# EAGLE schematic microBoard_power (EAGLE 6.2)

## Sheet 1 of 8: Power-supplies
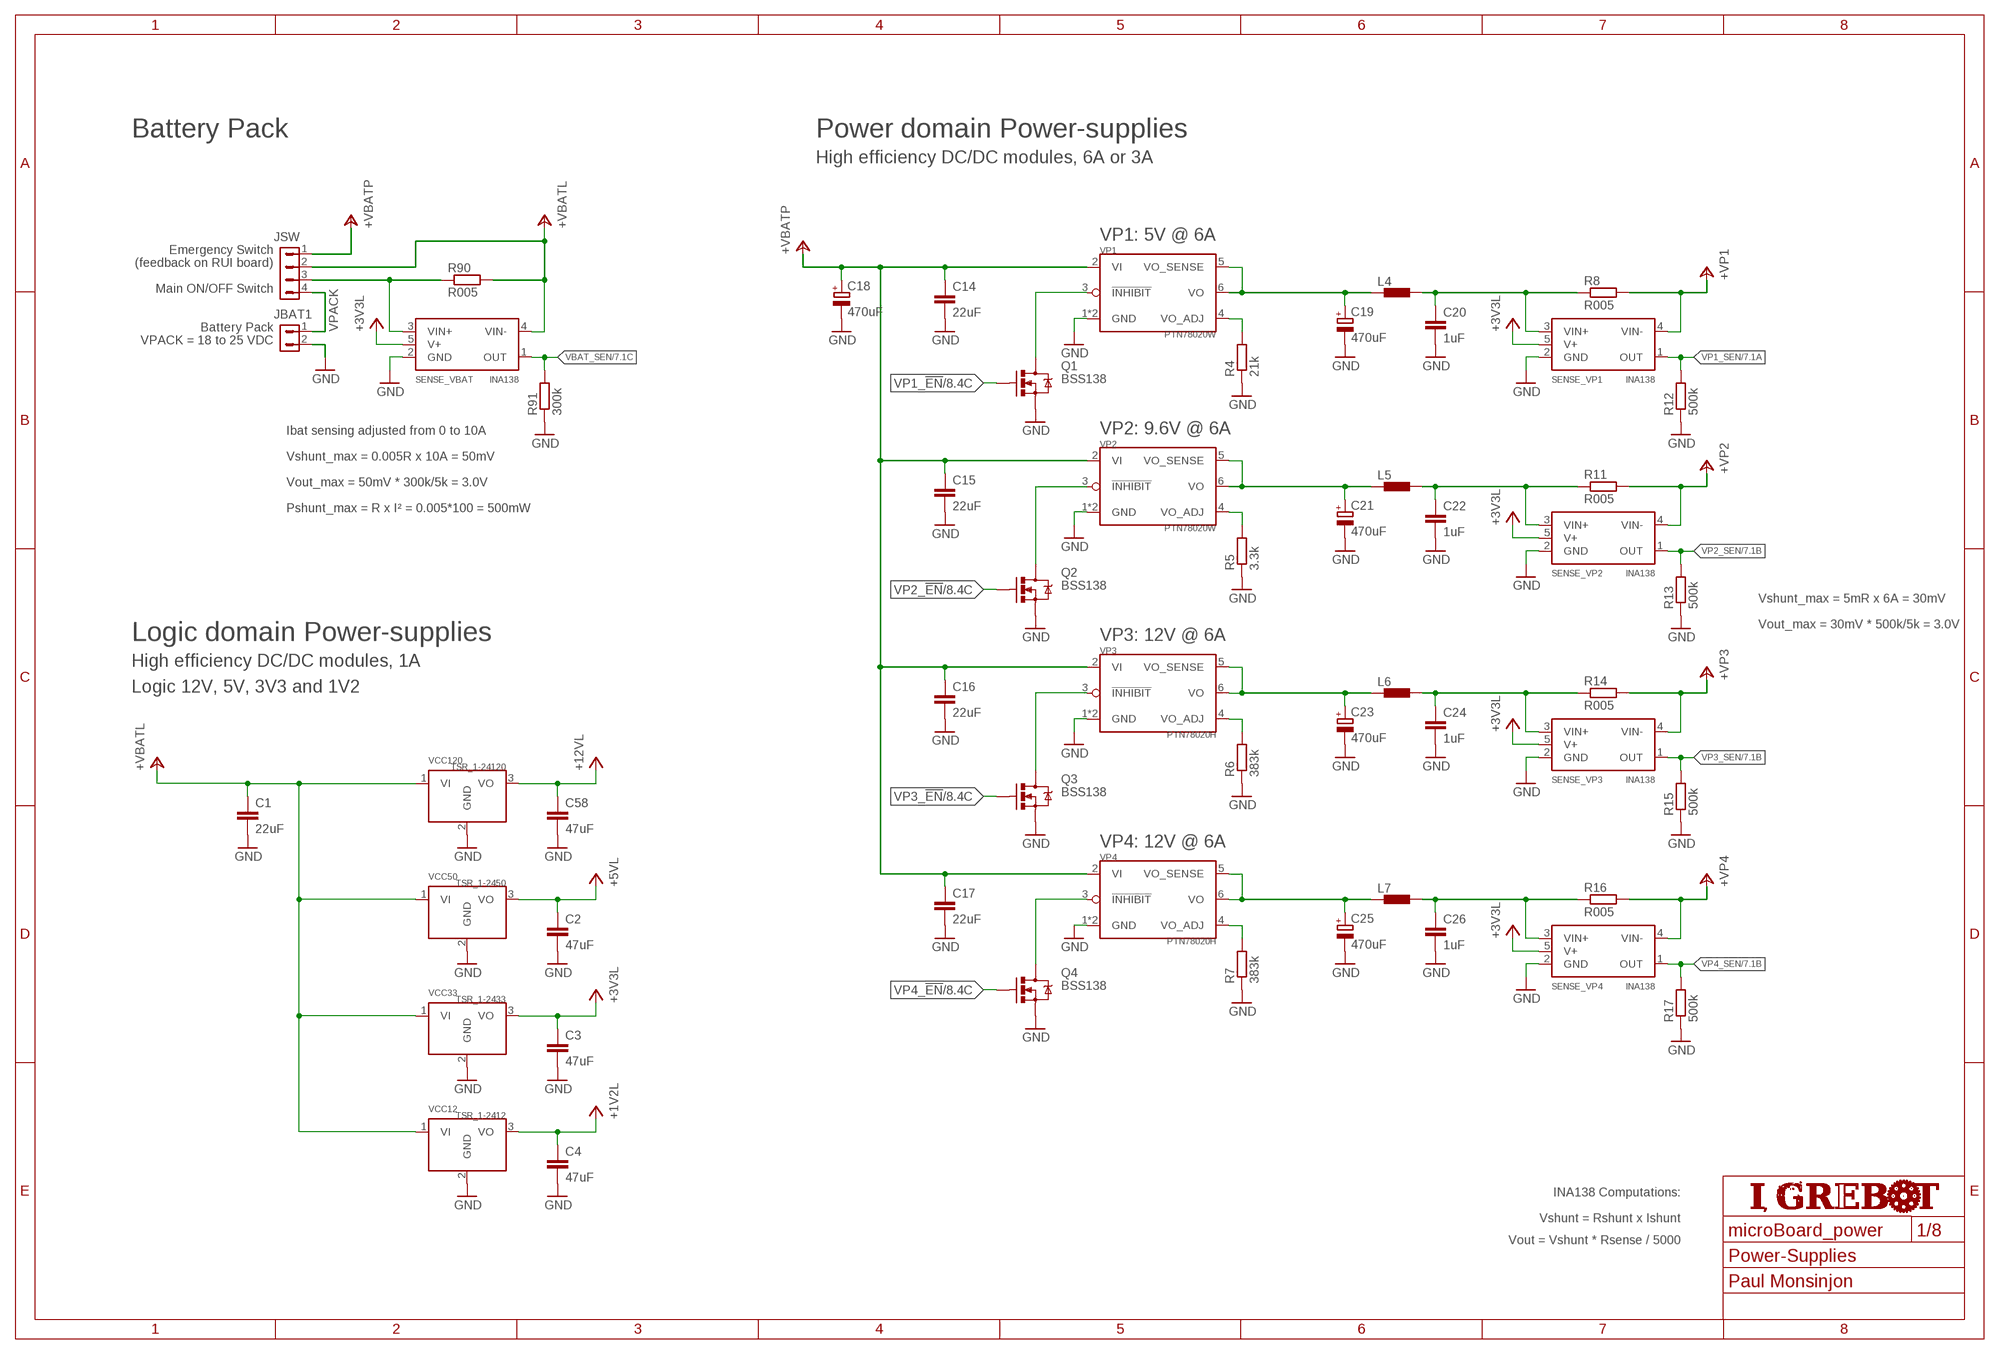
[diagram p0: schematic, sheet 1]
POWER-SUPPLIES (FRAME_A3): AUTHOR: Paul Monsinjon; SHEET_NAME: Power-Supplies

### Parts
C1  22uF  C-EUC3225  [C3225]
C2  47uF  C-EUC1210  [C1210]
C3  47uF  C-EUC1210  [C1210]
C4  47uF  C-EUC1210  [C1210]
C14  22uF  C-EUC3225  [C3225]
C15  22uF  C-EUC3225  [C3225]
C16  22uF  C-EUC3225  [C3225]
C17  22uF  C-EUC3225  [C3225]
C18  470uF  CPOL-EUB  [PANASONIC_B]
C19  470uF  CPOL-EUD  [PANASONIC_D]
C20  1uF  C-EUC3225  [C3225]
C21  470uF  CPOL-EUD  [PANASONIC_D]
C22  1uF  C-EUC3225  [C3225]
C23  470uF  CPOL-EUD  [PANASONIC_D]
C24  1uF  C-EUC3225  [C3225]
C25  470uF  CPOL-EUD  [PANASONIC_D]
C26  1uF  C-EUC3225  [C3225]
C58  47uF  C-EUC1210  [C1210]
JBAT1  MC15-GF-3.81-LR_2  [CON_3.81_LR_2]
JSW  MC15-GF-3.81-LR_4  [CON_3.81_LR_4]
L4  DR1030  [DR1030]
L5  DR1030  [DR1030]
L6  DR1030  [DR1030]
L7  DR1030  [DR1030]
Q1  BSS138  MOSFET-NCHANNELBSS138  [SOT23]
Q2  BSS138  MOSFET-NCHANNELBSS138  [SOT23]
Q3  BSS138  MOSFET-NCHANNELBSS138  [SOT23]
Q4  BSS138  MOSFET-NCHANNELBSS138  [SOT23]
R4  21k  R-EU_R0603  [R0603]
R5  3.3k  R-EU_R0603  [R0603]
R6  383k  R-EU_R0603  [R0603]
R7  383k  R-EU_R0603  [R0603]
R8  R005  R-EU_R2512  [R2512]
R11  R005  R-EU_R2512  [R2512]
R12  500k  R-EU_R0603  [R0603]
R13  500k  R-EU_R0603  [R0603]
R14  R005  R-EU_R2512  [R2512]
R15  500k  R-EU_R0603  [R0603]
R16  R005  R-EU_R2512  [R2512]
R17  500k  R-EU_R0603  [R0603]
R90  R005  R-EU_R2512  [R2512]
R91  300k  R-EU_R0603  [R0603]
SENSE_VBAT  INA138  [DBV_05]
SENSE_VP1  INA138  [DBV_05]
SENSE_VP2  INA138  [DBV_05]
SENSE_VP3  INA138  [DBV_05]
SENSE_VP4  INA138  [DBV_05]
VCC12  TSR_1-2412  TSR_1-24XX  [TSR1]
VCC33  TSR_1-2433  TSR_1-24XX  [TSR1]
VCC50  TSR_1-2450  TSR_1-24XX  [TSR1]
VCC120  TSR_1-24120  TSR_1-24XX  [TSR1]
VP1  PTN78020W  [PTN78020]
VP2  PTN78020W  [PTN78020]
VP3  PTN78020H  PTN78020W  [PTN78020]
VP4  PTN78020H  PTN78020W  [PTN78020]

### Nets
!INHIBIT!_VP1: Q1.3(D) VP1.3(!INHIBIT!)
!INHIBIT!_VP5: Q2.3(D) VP2.3(!INHIBIT!)
!INHIBIT!_VP6: Q3.3(D) VP3.3(!INHIBIT!)
!INHIBIT!_VP7: Q4.3(D) VP4.3(!INHIBIT!)
+1V2L: C4.1 VCC12.3(VO) ; also sheet 8
+3V3L: C3.1 SENSE_VBAT.5(V+) SENSE_VP1.5(V+) SENSE_VP2.5(V+) SENSE_VP3.5(V+) SENSE_VP4.5(V+) VCC33.3(VO) ; also sheet 3,7,8
+5VL: C2.1 VCC50.3(VO) ; also sheet 2,8
+12VL: C58.1 VCC120.3(VO) ; also sheet 8
+VBATL: C1.1 JSW.2 R90.2 SENSE_VBAT.4(VIN-) VCC12.1(VI) VCC33.1(VI) VCC50.1(VI) VCC120.1(VI)
+VBATP: C14.1 C15.1 C16.1 C17.1 C18.+ JSW.1 VP1.2(VI) VP2.2(VI) VP3.2(VI) VP4.2(VI) ; also sheet 3
+VP1: R8.2 SENSE_VP1.4(VIN-) ; also sheet 6
+VP2: R11.2 SENSE_VP2.4(VIN-) ; also sheet 6
+VP3: R14.2 SENSE_VP3.4(VIN-) ; also sheet 3
+VP4: R16.2 SENSE_VP4.4(VIN-) ; also sheet 4,5
GND: C1.2 C2.2 C3.2 C4.2 C14.2 C15.2 C16.2 C17.2 C18.- C19.- C20.2 C21.- C22.2 C23.- C24.2 C25.- C26.2 C58.2 JBAT1.2 Q1.2(S) Q2.2(S) Q3.2(S) Q4.2(S) R4.1 R5.1 R6.1 R7.1 R12.1 R13.1 R15.1 R17.1 R91.1 SENSE_VBAT.2(GND) SENSE_VP1.2(GND) SENSE_VP2.2(GND) SENSE_VP3.2(GND) SENSE_VP4.2(GND) VCC12.2(GND) VCC33.2(GND) VCC50.2(GND) VCC120.2(GND) VP1.1(GND) VP1.7(GND) VP2.1(GND) VP2.7(GND) VP3.1(GND) VP3.7(GND) VP4.1(GND) VP4.7(GND) ; also sheet 2,3,4,5,6,7,8
N$1: C19.+ L4.1 VP1.5(VO_SENSE) VP1.6(VO)
N$2: R7.2 VP4.4(VO_ADJ)
N$3: C20.1 L4.2 R8.1 SENSE_VP1.3(VIN+)
N$4: R6.2 VP3.4(VO_ADJ)
N$6: R5.2 VP2.4(VO_ADJ)
N$7: C21.+ L5.1 VP2.5(VO_SENSE) VP2.6(VO)
N$8: R4.2 VP1.4(VO_ADJ)
N$12: C22.1 L5.2 R11.1 SENSE_VP2.3(VIN+)
N$13: C23.+ L6.1 VP3.5(VO_SENSE) VP3.6(VO)
N$14: C24.1 L6.2 R14.1 SENSE_VP3.3(VIN+)
N$15: C25.+ L7.1 VP4.5(VO_SENSE) VP4.6(VO)
N$16: C26.1 L7.2 R16.1 SENSE_VP4.3(VIN+)
N$43: JSW.3 R90.1 SENSE_VBAT.3(VIN+)
VBAT_SEN: R91.2 SENSE_VBAT.1(OUT) ; also sheet 7
VP1_!EN!: Q1.1(G) ; also sheet 8
VP1_SEN: R12.2 SENSE_VP1.1(OUT) ; also sheet 7
VP2_!EN!: Q2.1(G) ; also sheet 8
VP2_SEN: R13.2 SENSE_VP2.1(OUT) ; also sheet 7
VP3_!EN!: Q3.1(G) ; also sheet 8
VP3_SEN: R15.2 SENSE_VP3.1(OUT) ; also sheet 7
VP4_!EN!: Q4.1(G) ; also sheet 8
VP4_SEN: R17.2 SENSE_VP4.1(OUT) ; also sheet 7
VPACK: JBAT1.1 JSW.4

### Notes on the sheet
- Battery Pack | Power domain Power-supplies
- High efficiency DC/DC modules, 6A or 3A
- VP1: 5V @ 6A
- Emergency Switch
- (feedback on RUI board)
- Main ON/OFF Switch
- Battery Pack
- VPACK = 18 to 25 VDC
- Ibat sensing adjusted from 0 to 10A | VP2: 9.6V @ 6A
- Vshunt_max = 0.005R x 10A = 50mV
- Vout_max = 50mV * 300k/5k = 3.0V
- Pshunt_max = R x I² = 0.005*100 = 500mW
- Vshunt_max = 5mR x 6A = 30mV
- Vout_max = 30mV * 500k/5k = 3.0V
- Logic domain Power-supplies | VP3: 12V @ 6A
- High efficiency DC/DC modules, 1A
- Logic 12V, 5V, 3V3 and 1V2
- VP4: 12V @ 6A
- INA138 Computations:
- Vshunt = Rshunt x Ishunt
- Vout = Vshunt * Rsense / 5000

## Sheet 2 of 8: Battery Monitoring
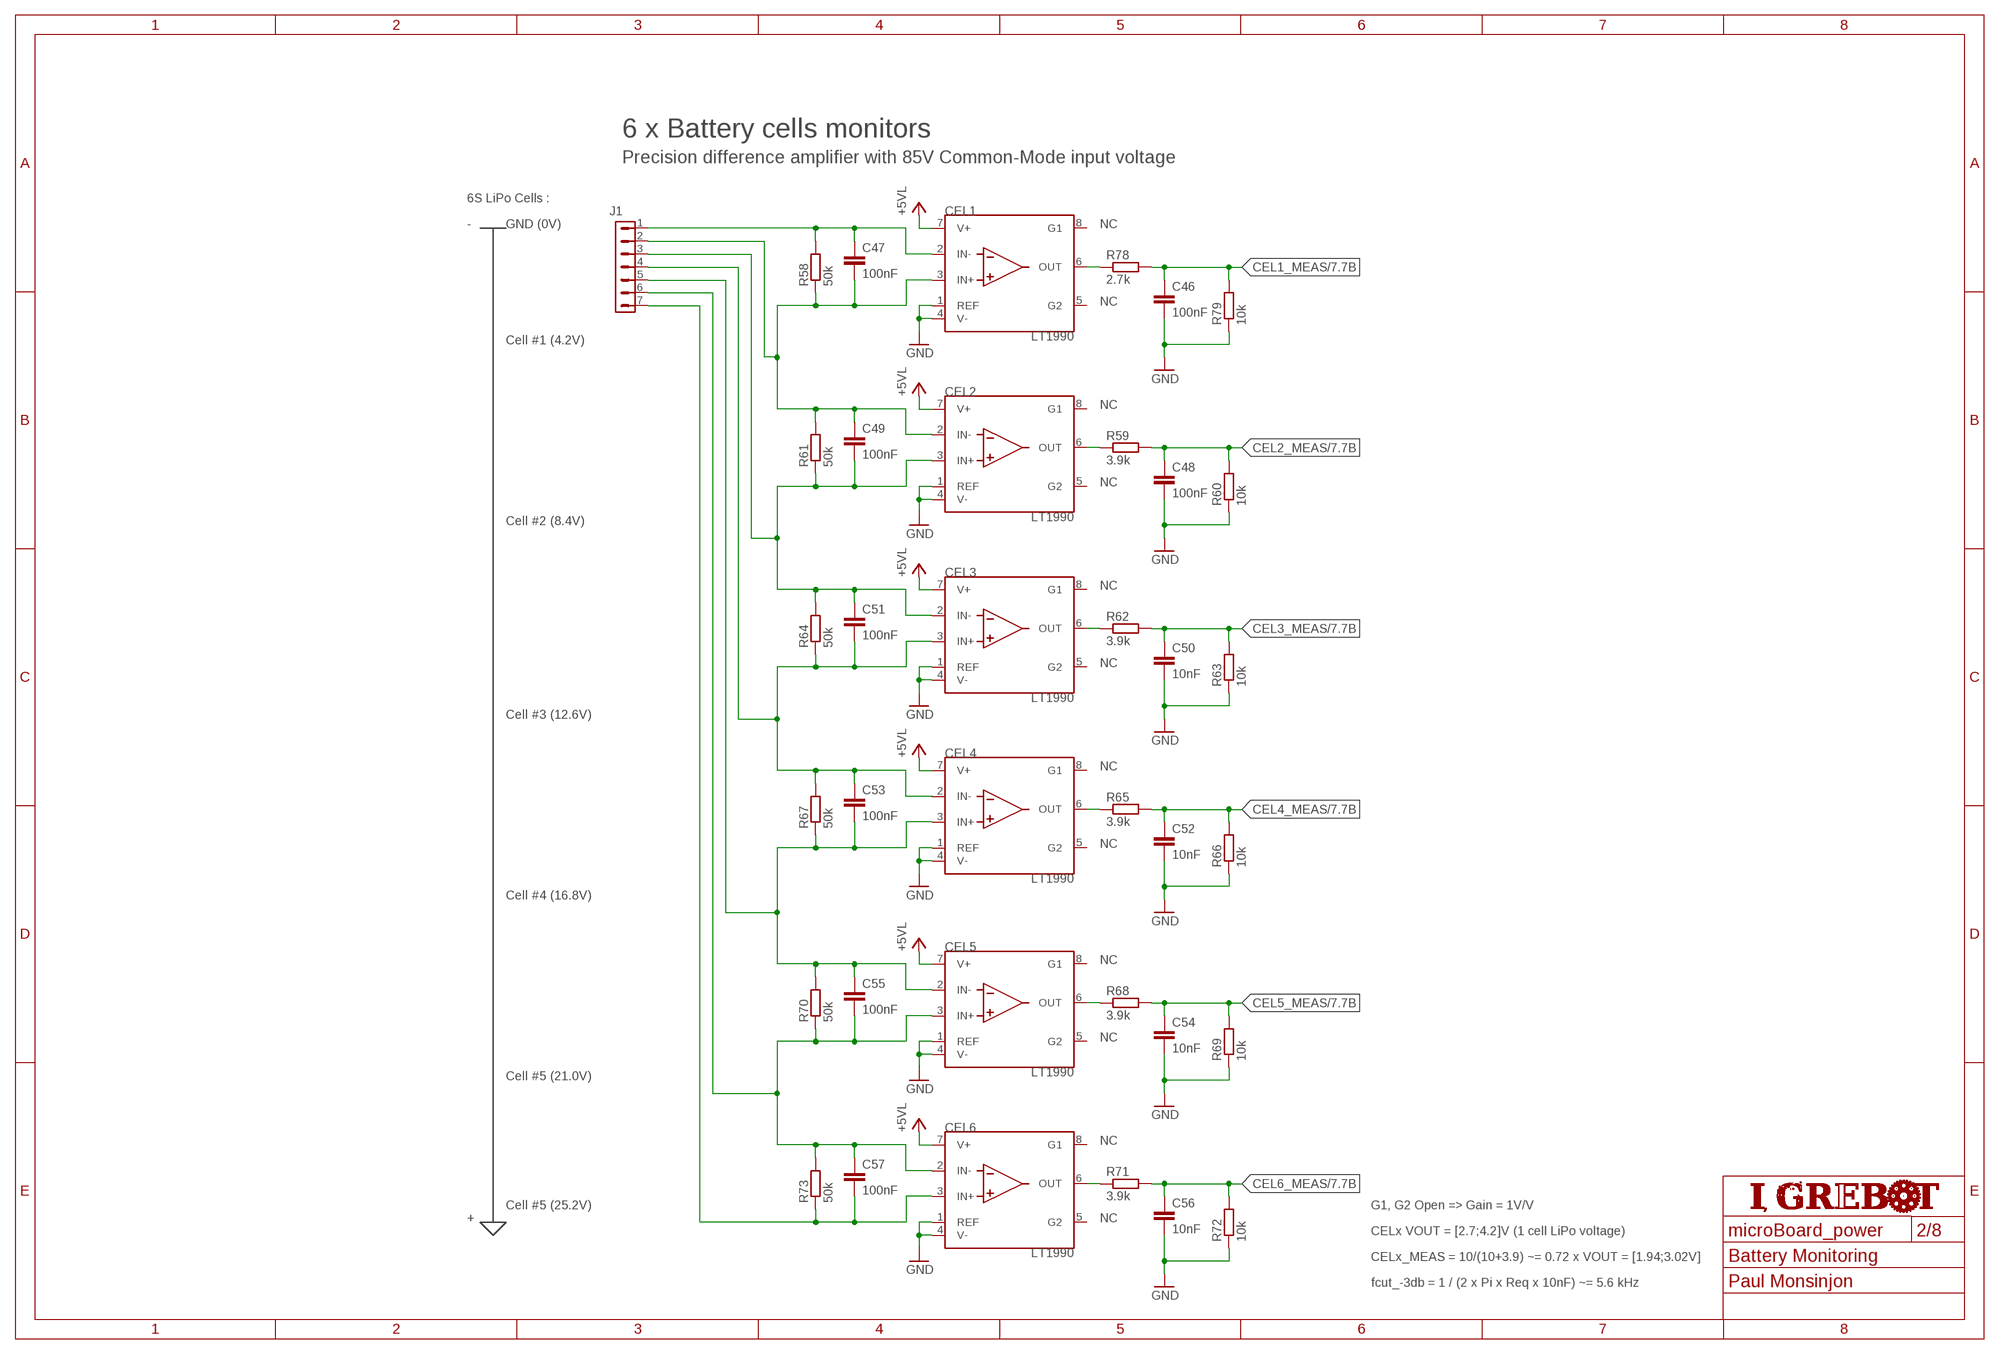
[diagram p1: schematic, sheet 2]
POWER-SUPPLIES2 (FRAME_A3): AUTHOR: Paul Monsinjon; SHEET_NAME: Battery Monitoring

### Parts
C46  100nF  C-EUC0603  [C0603]
C47  100nF  C-EUC0603  [C0603]
C48  100nF  C-EUC0603  [C0603]
C49  100nF  C-EUC0603  [C0603]
C50  10nF  C-EUC0603  [C0603]
C51  100nF  C-EUC0603  [C0603]
C52  10nF  C-EUC0603  [C0603]
C53  100nF  C-EUC0603  [C0603]
C54  10nF  C-EUC0603  [C0603]
C55  100nF  C-EUC0603  [C0603]
C56  10nF  C-EUC0603  [C0603]
C57  100nF  C-EUC0603  [C0603]
CEL1  LT1990  [S8]
CEL2  LT1990  [S8]
CEL3  LT1990  [S8]
CEL4  LT1990  [S8]
CEL5  LT1990  [S8]
CEL6  LT1990  [S8]
J1  JST-XH-S_7  [JST-XH-7S]
R58  50k  R-EU_R0603  [R0603]
R59  3.9k  R-EU_R0603  [R0603]
R60  10k  R-EU_R0603  [R0603]
R61  50k  R-EU_R0603  [R0603]
R62  3.9k  R-EU_R0603  [R0603]
R63  10k  R-EU_R0603  [R0603]
R64  50k  R-EU_R0603  [R0603]
R65  3.9k  R-EU_R0603  [R0603]
R66  10k  R-EU_R0603  [R0603]
R67  50k  R-EU_R0603  [R0603]
R68  3.9k  R-EU_R0603  [R0603]
R69  10k  R-EU_R0603  [R0603]
R70  50k  R-EU_R0603  [R0603]
R71  3.9k  R-EU_R0603  [R0603]
R72  10k  R-EU_R0603  [R0603]
R73  50k  R-EU_R0603  [R0603]
R78  2.7k  R-EU_R0603  [R0603]
R79  10k  R-EU_R0603  [R0603]

### Nets
+5VL: CEL1.7(V+) CEL2.7(V+) CEL3.7(V+) CEL4.7(V+) CEL5.7(V+) CEL6.7(V+) ; also sheet 1,8
CEL1_MEAS: C46.1 R78.2 R79.2 ; also sheet 7
CEL2_MEAS: C48.1 R59.2 R60.2 ; also sheet 7
CEL3_MEAS: C50.1 R62.2 R63.2 ; also sheet 7
CEL4_MEAS: C52.1 R65.2 R66.2 ; also sheet 7
CEL5_MEAS: C54.1 R68.2 R69.2 ; also sheet 7
CEL6_MEAS: C56.1 R71.2 R72.2 ; also sheet 7
GND: C46.2 C48.2 C50.2 C52.2 C54.2 C56.2 CEL1.1(REF) CEL1.4(V-) CEL2.1(REF) CEL2.4(V-) CEL3.1(REF) CEL3.4(V-) CEL4.1(REF) CEL4.4(V-) CEL5.1(REF) CEL5.4(V-) CEL6.1(REF) CEL6.4(V-) R60.1 R63.1 R66.1 R69.1 R72.1 R79.1 ; also sheet 1,3,4,5,6,7,8
N$103: CEL1.6(OUT) R78.1
N$104: C47.1 CEL1.2(IN-) J1.1 R58.2
N$105: C47.2 C49.1 CEL1.3(IN+) CEL2.2(IN-) J1.2 R58.1 R61.2
N$106: CEL2.6(OUT) R59.1
N$108: C49.2 C51.1 CEL2.3(IN+) CEL3.2(IN-) J1.3 R61.1 R64.2
N$109: CEL3.6(OUT) R62.1
N$111: C51.2 C53.1 CEL3.3(IN+) CEL4.2(IN-) J1.4 R64.1 R67.2
N$112: CEL4.6(OUT) R65.1
N$114: C53.2 C55.1 CEL4.3(IN+) CEL5.2(IN-) J1.5 R67.1 R70.2
N$115: CEL5.6(OUT) R68.1
N$116: C55.2 C57.1 CEL5.3(IN+) CEL6.2(IN-) J1.6 R70.1 R73.2
N$118: CEL6.6(OUT) R71.1
N$120: C57.2 CEL6.3(IN+) J1.7 R73.1
Unconnected: CEL1.5(G2) CEL1.8(G1) CEL2.5(G2) CEL2.8(G1) CEL3.5(G2) CEL3.8(G1) CEL4.5(G2) CEL4.8(G1) CEL5.5(G2) CEL5.8(G1) CEL6.5(G2) CEL6.8(G1)

### Notes on the sheet
- 6 x Battery cells monitors
- Precision difference amplifier with 85V Common-Mode input voltage
- 6S LiPo Cells :
- - | GND (0V) | NC
- NC
- Cell #1 (4.2V)
- NC
- NC
- Cell #2 (8.4V)
- NC
- NC
- Cell #3 (12.6V)
- NC
- NC
- Cell #4 (16.8V)
- NC
- NC
- Cell #5 (21.0V)
- NC
- Cell #5 (25.2V) | G1, G2 Open => Gain = 1V/V
- + | NC
- CELx VOUT = [2.7;4.2]V (1 cell LiPo voltage)
- CELx_MEAS = 10/(10+3.9) ~= 0.72 x VOUT = [1.94;3.02V]
- fcut_-3db = 1 / (2 x Pi x Req x 10nF) ~= 5.6 kHz

## Sheet 3 of 8: Motor Drivers
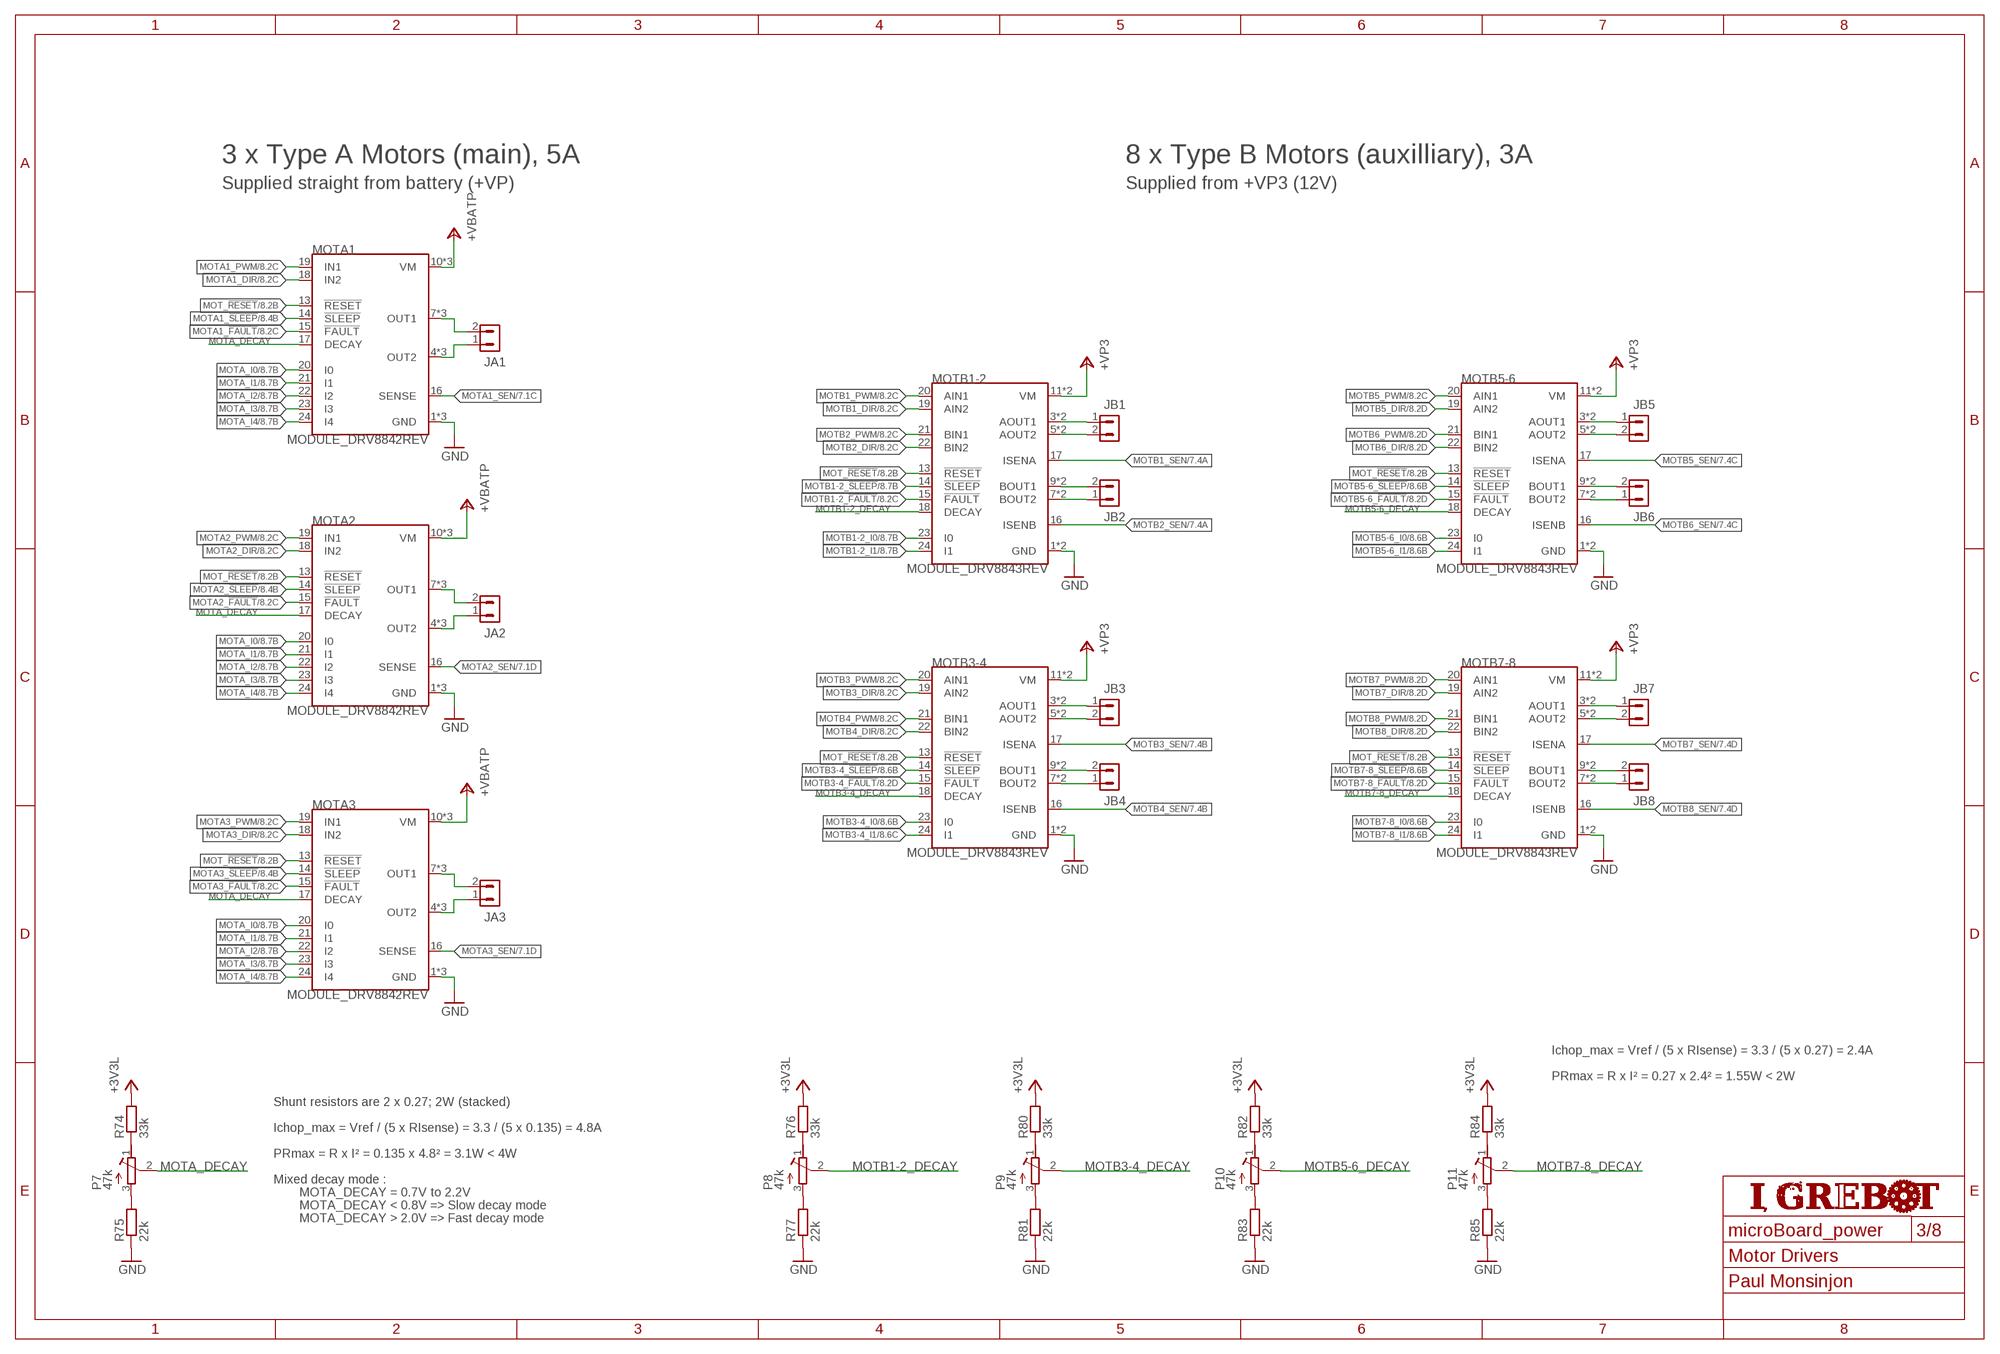
[diagram p2: schematic, sheet 3]
U$5 (FRAME_A3): AUTHOR: Paul Monsinjon; SHEET_NAME: Motor Drivers

### Parts
JA1  MC15-G-3-3.81_2  [CON_3.81_2]
JA2  MC15-G-3-3.81_2  [CON_3.81_2]
JA3  MC15-G-3-3.81_2  [CON_3.81_2]
JB1  MC15-G-3-3.81_2  [CON_3.81_2]
JB2  MC15-G-3-3.81_2  [CON_3.81_2]
JB3  MC15-G-3-3.81_2  [CON_3.81_2]
JB4  MC15-G-3-3.81_2  [CON_3.81_2]
JB5  MC15-G-3-3.81_2  [CON_3.81_2]
JB6  MC15-G-3-3.81_2  [CON_3.81_2]
JB7  MC15-G-3-3.81_2  [CON_3.81_2]
JB8  MC15-G-3-3.81_2  [CON_3.81_2]
MOTA1  MODULE_DRV8842REV  [MODULE_DRV884X_REV]
MOTA2  MODULE_DRV8842REV  [MODULE_DRV884X_REV]
MOTA3  MODULE_DRV8842REV  [MODULE_DRV884X_REV]
MOTB1-2  MODULE_DRV8843REV  [MODULE_DRV884X_REV]
MOTB3-4  MODULE_DRV8843REV  [MODULE_DRV884X_REV]
MOTB5-6  MODULE_DRV8843REV  [MODULE_DRV884X_REV]
MOTB7-8  MODULE_DRV8843REV  [MODULE_DRV884X_REV]
P7  47k  R-TRIMMT93XB  [RTRIMT93XB]
P8  47k  R-TRIMMT93XB  [RTRIMT93XB]
P9  47k  R-TRIMMT93XB  [RTRIMT93XB]
P10  47k  R-TRIMMT93XB  [RTRIMT93XB]
P11  47k  R-TRIMMT93XB  [RTRIMT93XB]
R74  33k  R-EU_R0603  [R0603]
R75  22k  R-EU_R0603  [R0603]
R76  33k  R-EU_R0603  [R0603]
R77  22k  R-EU_R0603  [R0603]
R80  33k  R-EU_R0603  [R0603]
R81  22k  R-EU_R0603  [R0603]
R82  33k  R-EU_R0603  [R0603]
R83  22k  R-EU_R0603  [R0603]
R84  33k  R-EU_R0603  [R0603]
R85  22k  R-EU_R0603  [R0603]

### Nets
+3V3L: R74.2 R76.2 R80.2 R82.2 R84.2 ; also sheet 1,7,8
+VBATP: MOTA1.10(VM) MOTA1.11(VM) MOTA1.12(VM) MOTA2.10(VM) MOTA2.11(VM) MOTA2.12(VM) MOTA3.10(VM) MOTA3.11(VM) MOTA3.12(VM) ; also sheet 1
+VP3: MOTB1-2.11(VM) MOTB1-2.12(VM) MOTB3-4.11(VM) MOTB3-4.12(VM) MOTB5-6.11(VM) MOTB5-6.12(VM) MOTB7-8.11(VM) MOTB7-8.12(VM) ; also sheet 1
GND: MOTA1.1(GND) MOTA1.2(GND) MOTA1.3(GND) MOTA2.1(GND) MOTA2.2(GND) MOTA2.3(GND) MOTA3.1(GND) MOTA3.2(GND) MOTA3.3(GND) MOTB1-2.1(GND) MOTB1-2.2(GND) MOTB3-4.1(GND) MOTB3-4.2(GND) MOTB5-6.1(GND) MOTB5-6.2(GND) MOTB7-8.1(GND) MOTB7-8.2(GND) R75.1 R77.1 R81.1 R83.1 R85.1 ; also sheet 1,2,4,5,6,7,8
MOT_!RESET!: MOTA1.13(!RESET!) MOTA2.13(!RESET!) MOTA3.13(!RESET!) MOTB1-2.13(!RESET!) MOTB3-4.13(!RESET!) MOTB5-6.13(!RESET!) MOTB7-8.13(!RESET!) ; also sheet 8
MOTA1_!FAULT!: MOTA1.15(!FAULT!) ; also sheet 8
MOTA1_!SLEEP!: MOTA1.14(!SLEEP!) ; also sheet 8
MOTA1_DIR: MOTA1.18(IN2) ; also sheet 8
MOTA1_PWM: MOTA1.19(IN1) ; also sheet 8
MOTA1_SEN: MOTA1.16(SENSE) ; also sheet 7
MOTA2_!FAULT!: MOTA2.15(!FAULT!) ; also sheet 8
MOTA2_!SLEEP!: MOTA2.14(!SLEEP!) ; also sheet 8
MOTA2_DIR: MOTA2.18(IN2) ; also sheet 8
MOTA2_PWM: MOTA2.19(IN1) ; also sheet 8
MOTA2_SEN: MOTA2.16(SENSE) ; also sheet 7
MOTA3_!FAULT!: MOTA3.15(!FAULT!) ; also sheet 8
MOTA3_!SLEEP!: MOTA3.14(!SLEEP!) ; also sheet 8
MOTA3_DIR: MOTA3.18(IN2) ; also sheet 8
MOTA3_PWM: MOTA3.19(IN1) ; also sheet 8
MOTA3_SEN: MOTA3.16(SENSE) ; also sheet 7
MOTA_DECAY: MOTA1.17(DECAY) MOTA2.17(DECAY) MOTA3.17(DECAY) P7.2(S)
MOTA_I0: MOTA1.20(I0) MOTA2.20(I0) MOTA3.20(I0) ; also sheet 8
MOTA_I1: MOTA1.21(I1) MOTA2.21(I1) MOTA3.21(I1) ; also sheet 8
MOTA_I2: MOTA1.22(I2) MOTA2.22(I2) MOTA3.22(I2) ; also sheet 8
MOTA_I3: MOTA1.23(I3) MOTA2.23(I3) MOTA3.23(I3) ; also sheet 8
MOTA_I4: MOTA1.24(I4) MOTA2.24(I4) MOTA3.24(I4) ; also sheet 8
MOTB1-2_!FAULT!: MOTB1-2.15(!FAULT!) ; also sheet 8
MOTB1-2_!SLEEP!: MOTB1-2.14(!SLEEP!) ; also sheet 8
MOTB1-2_DECAY: MOTB1-2.18(DECAY) P8.2(S)
MOTB1-2_I0: MOTB1-2.23(I0) ; also sheet 8
MOTB1-2_I1: MOTB1-2.24(I1) ; also sheet 8
MOTB1_DIR: MOTB1-2.19(AIN2) ; also sheet 8
MOTB1_PWM: MOTB1-2.20(AIN1) ; also sheet 8
MOTB1_SEN: MOTB1-2.17(ISENA) ; also sheet 7
MOTB2_DIR: MOTB1-2.22(BIN2) ; also sheet 8
MOTB2_PWM: MOTB1-2.21(BIN1) ; also sheet 8
MOTB2_SEN: MOTB1-2.16(ISENB) ; also sheet 7
MOTB3-4_!FAULT!: MOTB3-4.15(!FAULT!) ; also sheet 8
MOTB3-4_!SLEEP!: MOTB3-4.14(!SLEEP!) ; also sheet 8
MOTB3-4_DECAY: MOTB3-4.18(DECAY) P9.2(S)
MOTB3-4_I0: MOTB3-4.23(I0) ; also sheet 8
MOTB3-4_I1: MOTB3-4.24(I1) ; also sheet 8
MOTB3_DIR: MOTB3-4.19(AIN2) ; also sheet 8
MOTB3_PWM: MOTB3-4.20(AIN1) ; also sheet 8
MOTB3_SEN: MOTB3-4.17(ISENA) ; also sheet 7
MOTB4_DIR: MOTB3-4.22(BIN2) ; also sheet 8
MOTB4_PWM: MOTB3-4.21(BIN1) ; also sheet 8
MOTB4_SEN: MOTB3-4.16(ISENB) ; also sheet 7
MOTB5-6_!FAULT!: MOTB5-6.15(!FAULT!) ; also sheet 8
MOTB5-6_!SLEEP!: MOTB5-6.14(!SLEEP!) ; also sheet 8
MOTB5-6_DECAY: MOTB5-6.18(DECAY) P10.2(S)
MOTB5-6_I0: MOTB5-6.23(I0) ; also sheet 8
MOTB5-6_I1: MOTB5-6.24(I1) ; also sheet 8
MOTB5_DIR: MOTB5-6.19(AIN2) ; also sheet 8
MOTB5_PWM: MOTB5-6.20(AIN1) ; also sheet 8
MOTB5_SEN: MOTB5-6.17(ISENA) ; also sheet 7
MOTB6_DIR: MOTB5-6.22(BIN2) ; also sheet 8
MOTB6_PWM: MOTB5-6.21(BIN1) ; also sheet 8
MOTB6_SEN: MOTB5-6.16(ISENB) ; also sheet 7
MOTB7-8_!FAULT!: MOTB7-8.15(!FAULT!) ; also sheet 8
MOTB7-8_!SLEEP!: MOTB7-8.14(!SLEEP!) ; also sheet 8
MOTB7-8_DECAY: MOTB7-8.18(DECAY) P11.2(S)
MOTB7-8_I0: MOTB7-8.23(I0) ; also sheet 8
MOTB7-8_I1: MOTB7-8.24(I1) ; also sheet 8
MOTB7_DIR: MOTB7-8.19(AIN2) ; also sheet 8
MOTB7_PWM: MOTB7-8.20(AIN1) ; also sheet 8
MOTB7_SEN: MOTB7-8.17(ISENA) ; also sheet 7
MOTB8_DIR: MOTB7-8.22(BIN2) ; also sheet 8
MOTB8_PWM: MOTB7-8.21(BIN1) ; also sheet 8
MOTB8_SEN: MOTB7-8.16(ISENB) ; also sheet 7
N$5: JA1.2 MOTA1.7(OUT1) MOTA1.8(OUT1) MOTA1.9(OUT1)
N$9: JA2.2 MOTA2.7(OUT1) MOTA2.8(OUT1) MOTA2.9(OUT1)
N$10: JB3.1 MOTB3-4.3(AOUT1) MOTB3-4.4(AOUT1)
N$11: JB3.2 MOTB3-4.5(AOUT2) MOTB3-4.6(AOUT2)
N$17: JB4.1 MOTB3-4.7(BOUT2) MOTB3-4.8(BOUT2)
N$18: JA2.1 MOTA2.4(OUT2) MOTA2.5(OUT2) MOTA2.6(OUT2)
N$19: JA1.1 MOTA1.4(OUT2) MOTA1.5(OUT2) MOTA1.6(OUT2)
N$20: JB1.1 MOTB1-2.3(AOUT1) MOTB1-2.4(AOUT1)
N$21: JB1.2 MOTB1-2.5(AOUT2) MOTB1-2.6(AOUT2)
N$22: JB2.2 MOTB1-2.9(BOUT1) MOTB1-2.10(BOUT1)
N$23: JA3.1 MOTA3.4(OUT2) MOTA3.5(OUT2) MOTA3.6(OUT2)
N$24: JA3.2 MOTA3.7(OUT1) MOTA3.8(OUT1) MOTA3.9(OUT1)
N$25: JB4.2 MOTB3-4.9(BOUT1) MOTB3-4.10(BOUT1)
N$26: JB5.1 MOTB5-6.3(AOUT1) MOTB5-6.4(AOUT1)
N$27: JB5.2 MOTB5-6.5(AOUT2) MOTB5-6.6(AOUT2)
N$28: JB6.2 MOTB5-6.9(BOUT1) MOTB5-6.10(BOUT1)
N$29: JB2.1 MOTB1-2.7(BOUT2) MOTB1-2.8(BOUT2)
N$30: JB6.1 MOTB5-6.7(BOUT2) MOTB5-6.8(BOUT2)
N$31: JB7.1 MOTB7-8.3(AOUT1) MOTB7-8.4(AOUT1)
N$32: JB7.2 MOTB7-8.5(AOUT2) MOTB7-8.6(AOUT2)
N$33: JB8.2 MOTB7-8.9(BOUT1) MOTB7-8.10(BOUT1)
N$34: JB8.1 MOTB7-8.7(BOUT2) MOTB7-8.8(BOUT2)
N$121: P7.3(E) R75.2
N$122: P7.1(A) R74.1
N$123: P8.3(E) R77.2
N$124: P8.1(A) R76.1
N$125: P9.3(E) R81.2
N$126: P9.1(A) R80.1
N$127: P10.3(E) R83.2
N$128: P10.1(A) R82.1
N$129: P11.3(E) R85.2
N$130: P11.1(A) R84.1

### Notes on the sheet
- 3 x Type A Motors (main), 5A | 8 x Type B Motors (auxilliary), 3A
- Supplied straight from battery (+VP) | Supplied from +VP3 (12V)
- Ichop_max = Vref / (5 x RIsense) = 3.3 / (5 x 0.27) = 2.4A
- PRmax = R x I² = 0.27 x 2.4² = 1.55W < 2W
- Shunt resistors are 2 x 0.27; 2W (stacked)
- Ichop_max = Vref / (5 x RIsense) = 3.3 / (5 x 0.135) = 4.8A
- PRmax = R x I² = 0.135 x 4.8² = 3.1W < 4W
- Mixed decay mode :
- MOTA_DECAY = 0.7V to 2.2V
- MOTA_DECAY < 0.8V => Slow decay mode
- MOTA_DECAY > 2.0V => Fast decay mode

## Sheet 4 of 8: On/Off Load Drivers
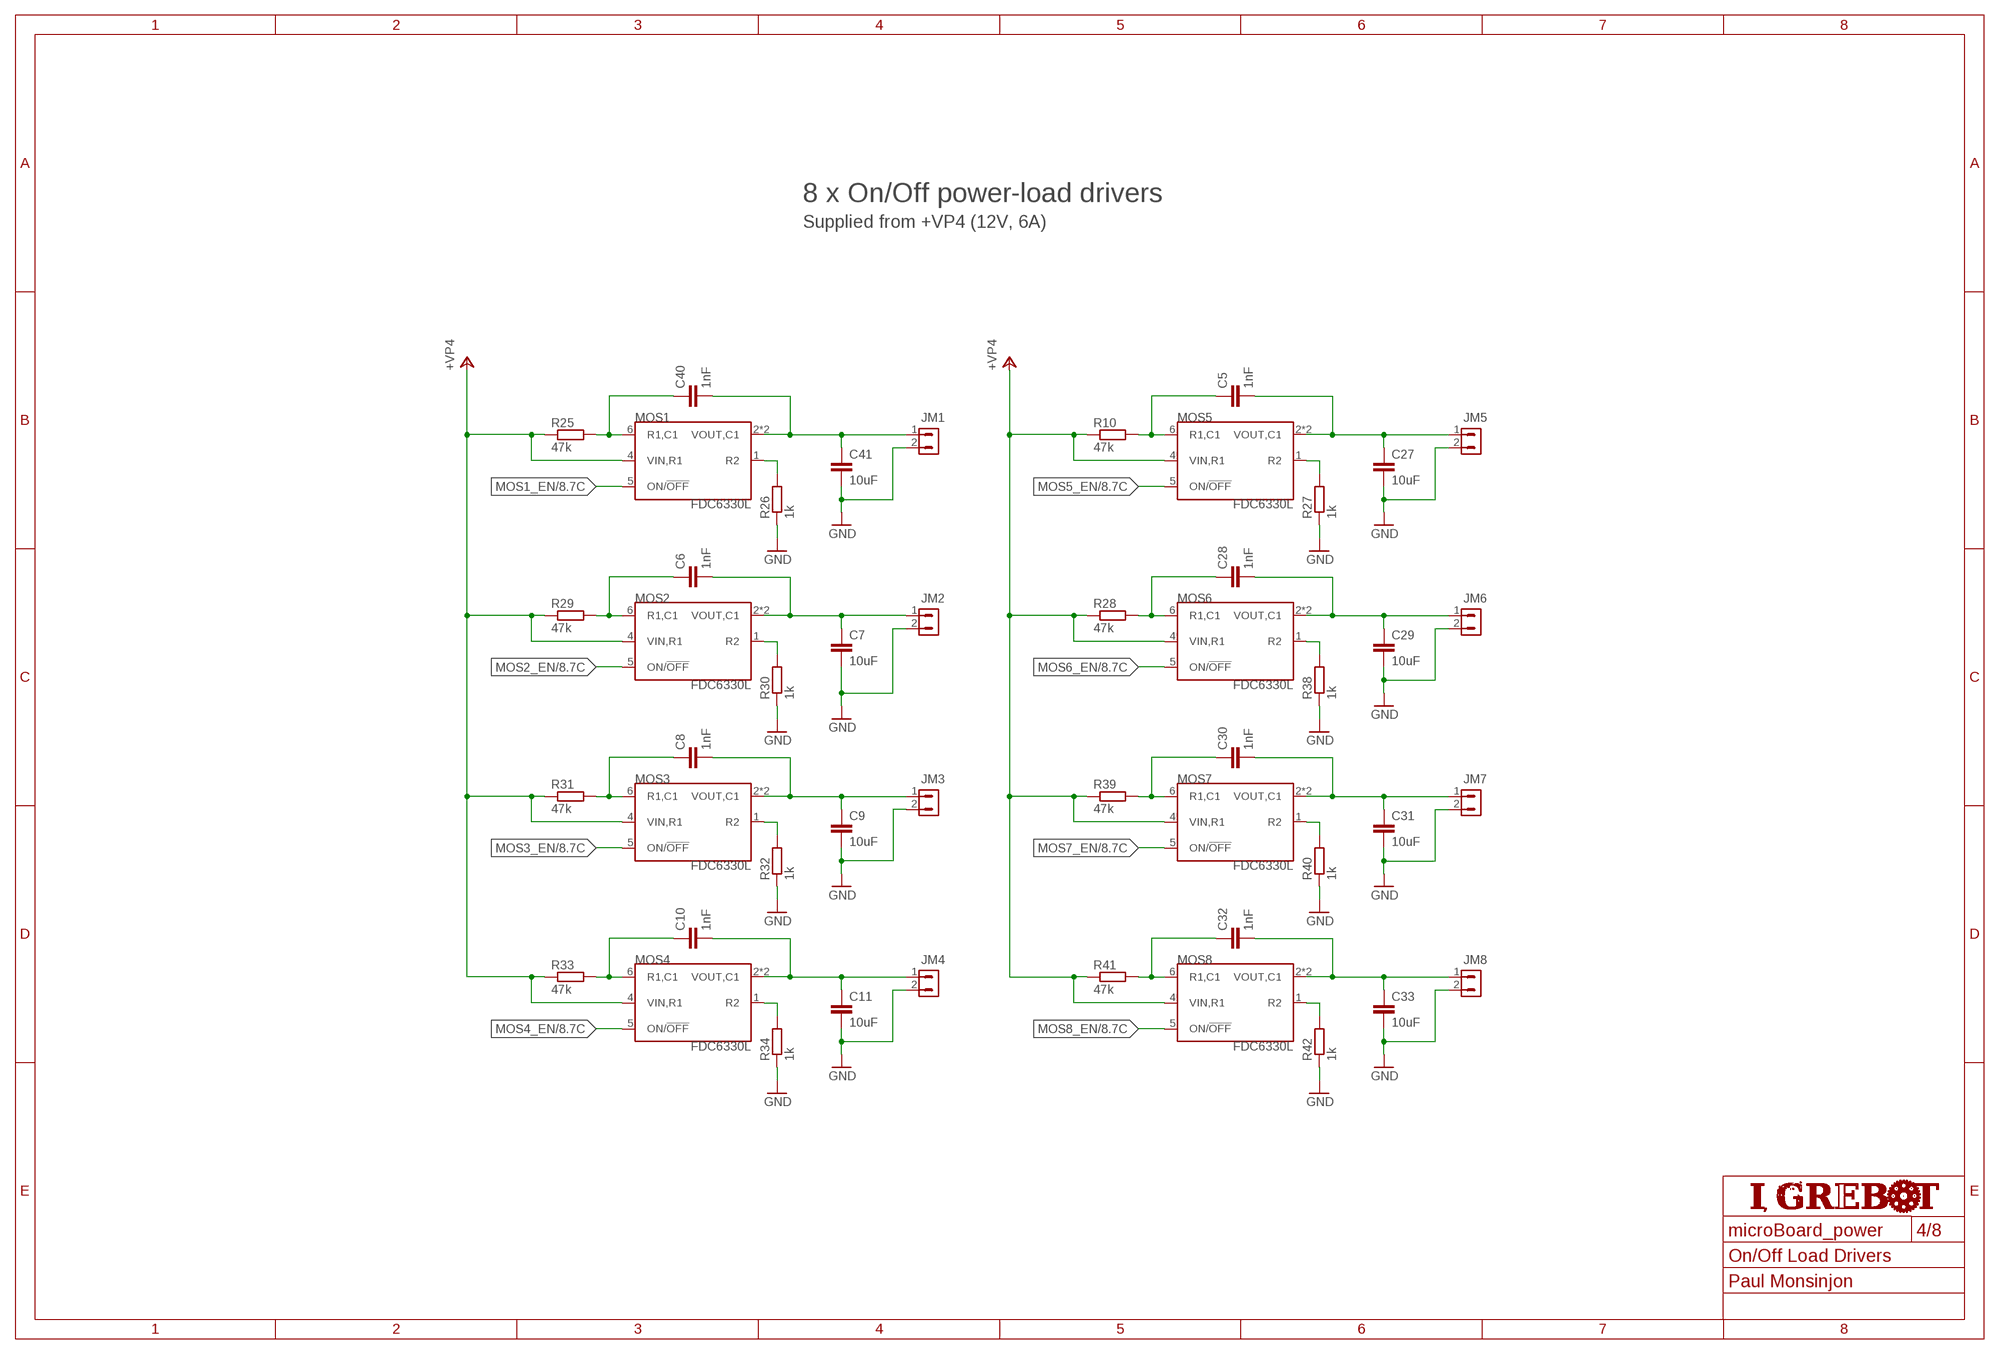
[diagram p3: schematic, sheet 4]
POWER-SUPPLIES3 (FRAME_A3): AUTHOR: Paul Monsinjon; SHEET_NAME: On/Off Load Drivers

### Parts
C5  1nF  C-EUC0603  [C0603]
C6  1nF  C-EUC0603  [C0603]
C7  10uF  C-EUC1210  [C1210]
C8  1nF  C-EUC0603  [C0603]
C9  10uF  C-EUC1210  [C1210]
C10  1nF  C-EUC0603  [C0603]
C11  10uF  C-EUC1210  [C1210]
C27  10uF  C-EUC1210  [C1210]
C28  1nF  C-EUC0603  [C0603]
C29  10uF  C-EUC1210  [C1210]
C30  1nF  C-EUC0603  [C0603]
C31  10uF  C-EUC1210  [C1210]
C32  1nF  C-EUC0603  [C0603]
C33  10uF  C-EUC1210  [C1210]
C40  1nF  C-EUC0603  [C0603]
C41  10uF  C-EUC1210  [C1210]
JM1  CON_2.54_H_2  [CON_2.54_H_2]
JM2  CON_2.54_H_2  [CON_2.54_H_2]
JM3  CON_2.54_H_2  [CON_2.54_H_2]
JM4  CON_2.54_H_2  [CON_2.54_H_2]
JM5  CON_2.54_H_2  [CON_2.54_H_2]
JM6  CON_2.54_H_2  [CON_2.54_H_2]
JM7  CON_2.54_H_2  [CON_2.54_H_2]
JM8  CON_2.54_H_2  [CON_2.54_H_2]
MOS1  FDC6330L  [SSOT-6]
MOS2  FDC6330L  [SSOT-6]
MOS3  FDC6330L  [SSOT-6]
MOS4  FDC6330L  [SSOT-6]
MOS5  FDC6330L  [SSOT-6]
MOS6  FDC6330L  [SSOT-6]
MOS7  FDC6330L  [SSOT-6]
MOS8  FDC6330L  [SSOT-6]
R10  47k  R-EU_R0603  [R0603]
R25  47k  R-EU_R0603  [R0603]
R26  1k  R-EU_R0603  [R0603]
R27  1k  R-EU_R0603  [R0603]
R28  47k  R-EU_R0603  [R0603]
R29  47k  R-EU_R0603  [R0603]
R30  1k  R-EU_R0603  [R0603]
R31  47k  R-EU_R0603  [R0603]
R32  1k  R-EU_R0603  [R0603]
R33  47k  R-EU_R0603  [R0603]
R34  1k  R-EU_R0603  [R0603]
R38  1k  R-EU_R0603  [R0603]
R39  47k  R-EU_R0603  [R0603]
R40  1k  R-EU_R0603  [R0603]
R41  47k  R-EU_R0603  [R0603]
R42  1k  R-EU_R0603  [R0603]

### Nets
+VP4: MOS1.4(VIN,R1) MOS2.4(VIN,R1) MOS3.4(VIN,R1) MOS4.4(VIN,R1) MOS5.4(VIN,R1) MOS6.4(VIN,R1) MOS7.4(VIN,R1) MOS8.4(VIN,R1) R10.1 R25.1 R28.1 R29.1 R31.1 R33.1 R39.1 R41.1 ; also sheet 1,5
GND: C7.2 C9.2 C11.2 C27.2 C29.2 C31.2 C33.2 C41.2 JM1.2 JM2.2 JM3.2 JM4.2 JM5.2 JM6.2 JM7.2 JM8.2 R26.1 R27.1 R30.1 R32.1 R34.1 R38.1 R40.1 R42.1 ; also sheet 1,2,3,5,6,7,8
MOS1_EN: MOS1.5(ON/!OFF!) ; also sheet 8
MOS1_OUT: C40.2 C41.1 JM1.1 MOS1.2(VOUT,C1) MOS1.3(VOUT,C1)
MOS2_EN: MOS2.5(ON/!OFF!) ; also sheet 8
MOS2_OUT: C6.2 C7.1 JM2.1 MOS2.2(VOUT,C1) MOS2.3(VOUT,C1)
MOS3_EN: MOS3.5(ON/!OFF!) ; also sheet 8
MOS3_OUT: C8.2 C9.1 JM3.1 MOS3.2(VOUT,C1) MOS3.3(VOUT,C1)
MOS4_EN: MOS4.5(ON/!OFF!) ; also sheet 8
MOS4_OUT: C10.2 C11.1 JM4.1 MOS4.2(VOUT,C1) MOS4.3(VOUT,C1)
MOS5_EN: MOS5.5(ON/!OFF!) ; also sheet 8
MOS5_OUT: C5.2 C27.1 JM5.1 MOS5.2(VOUT,C1) MOS5.3(VOUT,C1)
MOS6_EN: MOS6.5(ON/!OFF!) ; also sheet 8
MOS6_OUT: C28.2 C29.1 JM6.1 MOS6.2(VOUT,C1) MOS6.3(VOUT,C1)
MOS7_EN: MOS7.5(ON/!OFF!) ; also sheet 8
MOS7_OUT: C30.2 C31.1 JM7.1 MOS7.2(VOUT,C1) MOS7.3(VOUT,C1)
MOS8_EN: MOS8.5(ON/!OFF!) ; also sheet 8
MOS8_OUT: C32.2 C33.1 JM8.1 MOS8.2(VOUT,C1) MOS8.3(VOUT,C1)
N$42: MOS1.1(R2) R26.2
N$44: C5.1 MOS5.6(R1,C1) R10.2
N$45: C40.1 MOS1.6(R1,C1) R25.2
N$46: MOS5.1(R2) R27.2
N$49: C28.1 MOS6.6(R1,C1) R28.2
N$51: MOS6.1(R2) R38.2
N$60: C6.1 MOS2.6(R1,C1) R29.2
N$61: MOS2.1(R2) R30.2
N$63: C8.1 MOS3.6(R1,C1) R31.2
N$64: MOS3.1(R2) R32.2
N$66: C10.1 MOS4.6(R1,C1) R33.2
N$67: MOS4.1(R2) R34.2
N$75: C30.1 MOS7.6(R1,C1) R39.2
N$76: MOS7.1(R2) R40.2
N$78: C32.1 MOS8.6(R1,C1) R41.2
N$79: MOS8.1(R2) R42.2

### Notes on the sheet
- 8 x On/Off power-load drivers
- Supplied from +VP4 (12V, 6A)

## Sheet 5 of 8: Solenoid Drivers
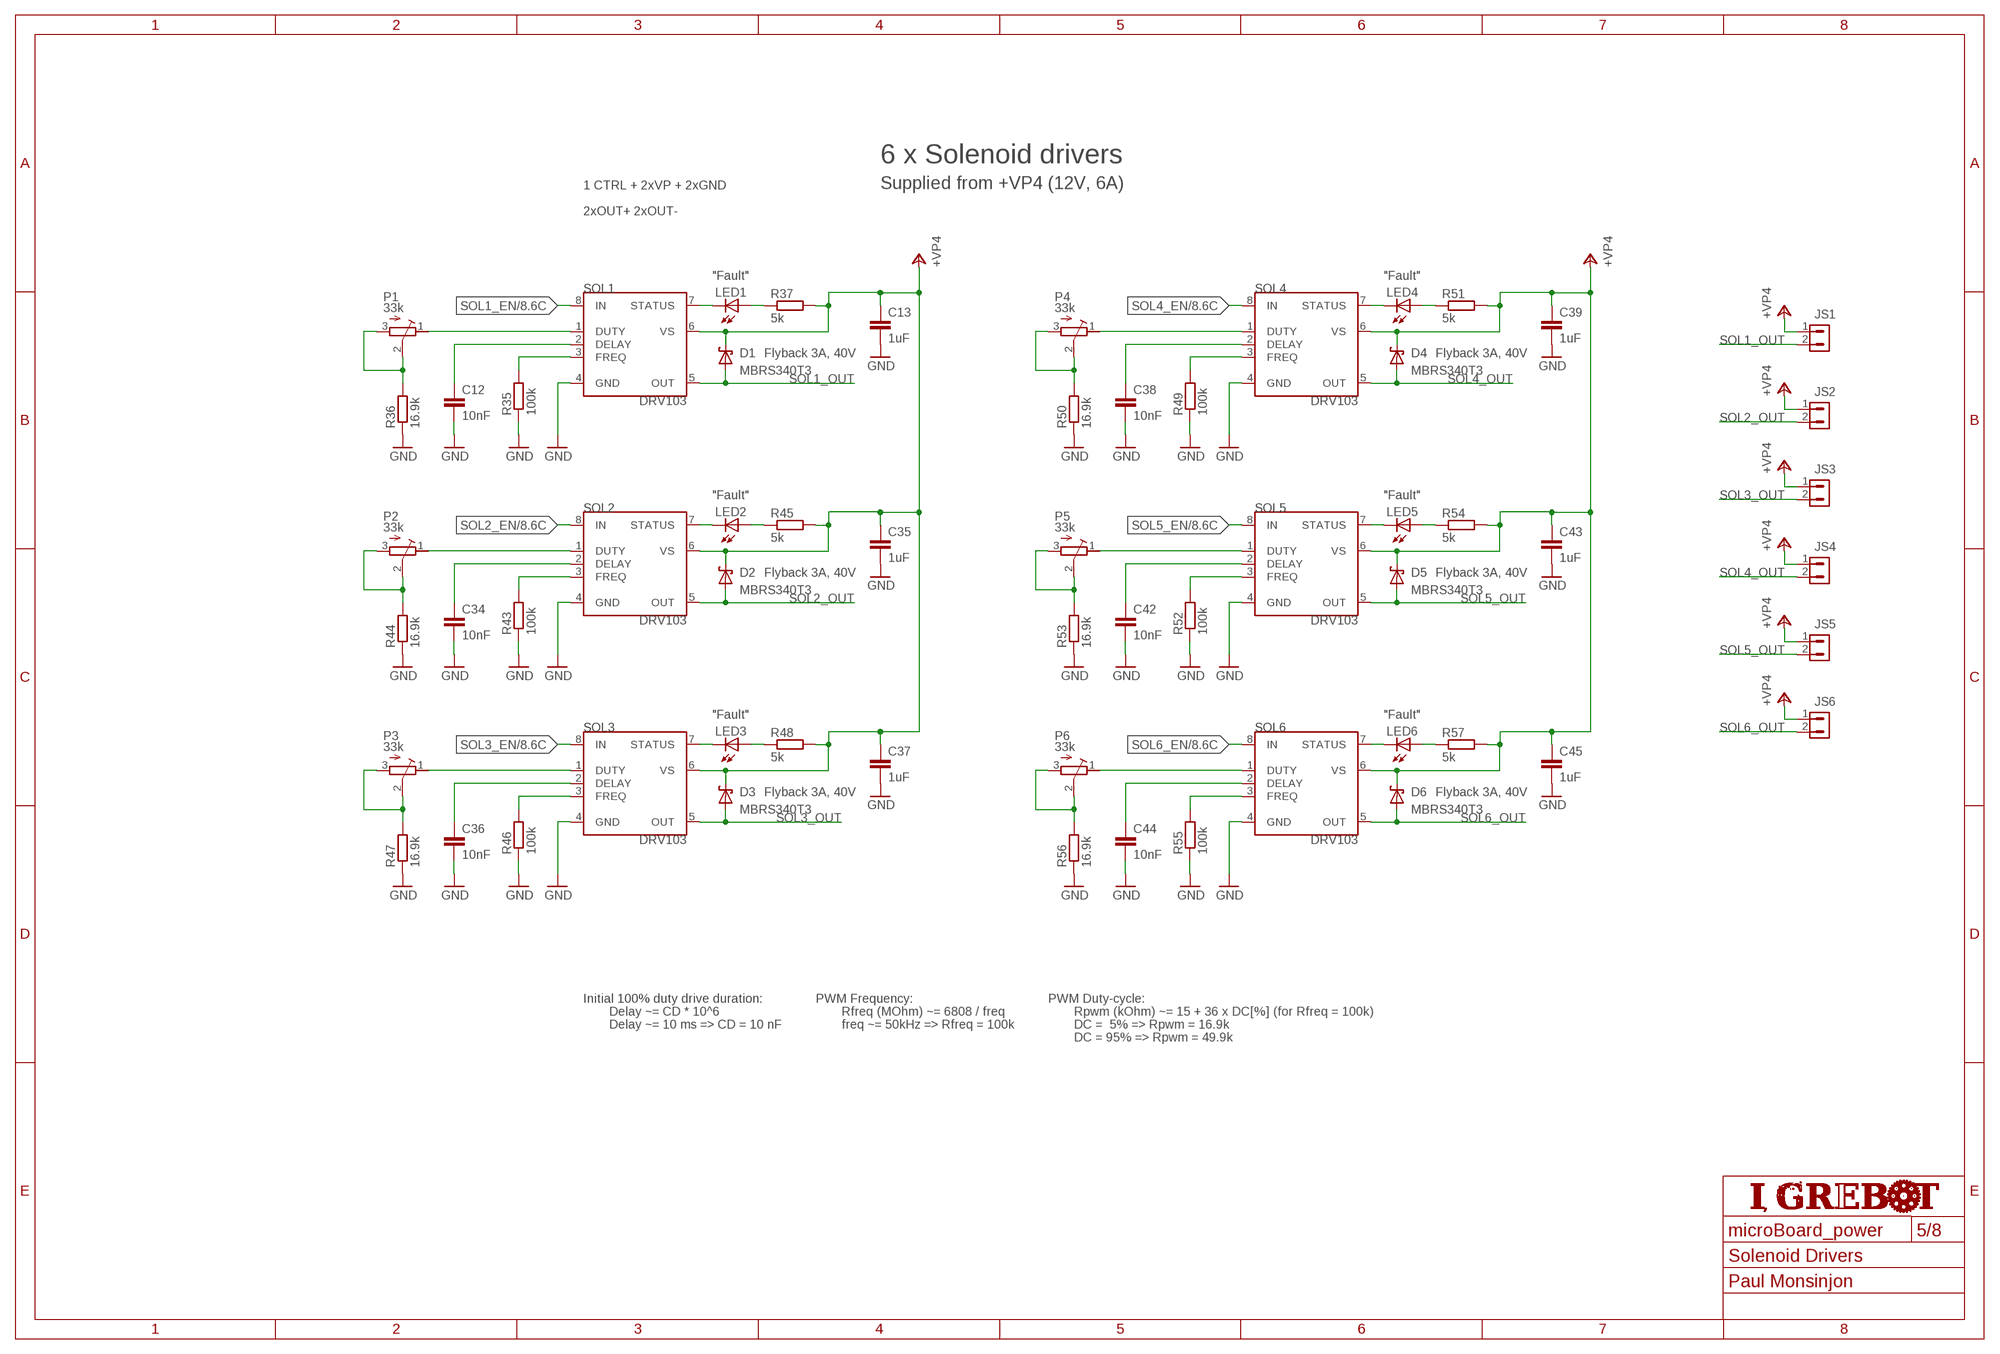
[diagram p4: schematic, sheet 5]
POWER-SUPPLIES5 (FRAME_A3): AUTHOR: Paul Monsinjon; SHEET_NAME: Solenoid Drivers

### Parts
C12  10nF  C-EUC0603  [C0603]
C13  1uF  C-EUC1210  [C1210]
C34  10nF  C-EUC0603  [C0603]
C35  1uF  C-EUC1210  [C1210]
C36  10nF  C-EUC0603  [C0603]
C37  1uF  C-EUC1210  [C1210]
C38  10nF  C-EUC0603  [C0603]
C39  1uF  C-EUC1210  [C1210]
C42  10nF  C-EUC0603  [C0603]
C43  1uF  C-EUC1210  [C1210]
C44  10nF  C-EUC0603  [C0603]
C45  1uF  C-EUC1210  [C1210]
D1  MBRS340T3  [SMC]
D2  MBRS340T3  [SMC]
D3  MBRS340T3  [SMC]
D4  MBRS340T3  [SMC]
D5  MBRS340T3  [SMC]
D6  MBRS340T3  [SMC]
JS1  CON_2.54_H_2  [CON_2.54_H_2]
JS2  CON_2.54_H_2  [CON_2.54_H_2]
JS3  CON_2.54_H_2  [CON_2.54_H_2]
JS4  CON_2.54_H_2  [CON_2.54_H_2]
JS5  CON_2.54_H_2  [CON_2.54_H_2]
JS6  CON_2.54_H_2  [CON_2.54_H_2]
LED1  LEDCHIPLED_0805  [CHIPLED_0805]
LED2  LEDCHIPLED_0805  [CHIPLED_0805]
LED3  LEDCHIPLED_0805  [CHIPLED_0805]
LED4  LEDCHIPLED_0805  [CHIPLED_0805]
LED5  LEDCHIPLED_0805  [CHIPLED_0805]
LED6  LEDCHIPLED_0805  [CHIPLED_0805]
P1  33k  R-TRIMMT93XB  [RTRIMT93XB]
P2  33k  R-TRIMMT93XB  [RTRIMT93XB]
P3  33k  R-TRIMMT93XB  [RTRIMT93XB]
P4  33k  R-TRIMMT93XB  [RTRIMT93XB]
P5  33k  R-TRIMMT93XB  [RTRIMT93XB]
P6  33k  R-TRIMMT93XB  [RTRIMT93XB]
R35  100k  R-EU_R0603  [R0603]
R36  16.9k  R-EU_R0603  [R0603]
R37  5k  R-EU_R0603  [R0603]
R43  100k  R-EU_R0603  [R0603]
R44  16.9k  R-EU_R0603  [R0603]
R45  5k  R-EU_R0603  [R0603]
R46  100k  R-EU_R0603  [R0603]
R47  16.9k  R-EU_R0603  [R0603]
R48  5k  R-EU_R0603  [R0603]
R49  100k  R-EU_R0603  [R0603]
R50  16.9k  R-EU_R0603  [R0603]
R51  5k  R-EU_R0603  [R0603]
R52  100k  R-EU_R0603  [R0603]
R53  16.9k  R-EU_R0603  [R0603]
R54  5k  R-EU_R0603  [R0603]
R55  100k  R-EU_R0603  [R0603]
R56  16.9k  R-EU_R0603  [R0603]
R57  5k  R-EU_R0603  [R0603]
SOL1  DRV103  [PWP_8]
SOL2  DRV103  [PWP_8]
SOL3  DRV103  [PWP_8]
SOL4  DRV103  [PWP_8]
SOL5  DRV103  [PWP_8]
SOL6  DRV103  [PWP_8]

### Nets
+VP4: C13.1 C35.1 C37.1 C39.1 C43.1 C45.1 D1.C D2.C D3.C D4.C D5.C D6.C JS1.1 JS2.1 JS3.1 JS4.1 JS5.1 JS6.1 R37.2 R45.2 R48.2 R51.2 R54.2 R57.2 SOL1.6(VS) SOL2.6(VS) SOL3.6(VS) SOL4.6(VS) SOL5.6(VS) SOL6.6(VS) ; also sheet 1,4
GND: C12.2 C13.2 C34.2 C35.2 C36.2 C37.2 C38.2 C39.2 C42.2 C43.2 C44.2 C45.2 R35.1 R36.1 R43.1 R44.1 R46.1 R47.1 R49.1 R50.1 R52.1 R53.1 R55.1 R56.1 SOL1.4(GND) SOL2.4(GND) SOL3.4(GND) SOL4.4(GND) SOL5.4(GND) SOL6.4(GND) ; also sheet 1,2,3,4,6,7,8
N$47: C38.1 SOL4.2(DELAY)
N$48: C34.1 SOL2.2(DELAY)
N$52: R43.2 SOL2.3(FREQ)
N$62: P2.1(A) SOL2.1(DUTY)
N$65: P2.2(S) P2.3(E) R44.2
N$68: LED2.C SOL2.7(STATUS)
N$69: C12.1 SOL1.2(DELAY)
N$70: R35.2 SOL1.3(FREQ)
N$71: P1.1(A) SOL1.1(DUTY)
N$72: P1.2(S) P1.3(E) R36.2
N$73: LED1.C SOL1.7(STATUS)
N$74: LED1.A R37.1
N$77: LED2.A R45.1
N$80: R49.2 SOL4.3(FREQ)
N$81: C36.1 SOL3.2(DELAY)
N$82: R46.2 SOL3.3(FREQ)
N$83: P3.1(A) SOL3.1(DUTY)
N$84: P3.2(S) P3.3(E) R47.2
N$85: LED3.C SOL3.7(STATUS)
N$86: LED3.A R48.1
N$87: P4.1(A) SOL4.1(DUTY)
N$88: P4.2(S) P4.3(E) R50.2
N$89: LED4.C SOL4.7(STATUS)
N$90: LED4.A R51.1
N$91: C42.1 SOL5.2(DELAY)
N$92: R52.2 SOL5.3(FREQ)
N$93: P5.1(A) SOL5.1(DUTY)
N$94: P5.2(S) P5.3(E) R53.2
N$95: LED5.C SOL5.7(STATUS)
N$96: LED5.A R54.1
N$97: C44.1 SOL6.2(DELAY)
N$98: R55.2 SOL6.3(FREQ)
N$99: P6.1(A) SOL6.1(DUTY)
N$100: P6.2(S) P6.3(E) R56.2
N$101: LED6.C SOL6.7(STATUS)
N$102: LED6.A R57.1
SOL1_EN: SOL1.8(IN) ; also sheet 8
SOL1_OUT: D1.A JS1.2 SOL1.5(OUT)
SOL2_EN: SOL2.8(IN) ; also sheet 8
SOL2_OUT: D2.A JS2.2 SOL2.5(OUT)
SOL3_EN: SOL3.8(IN) ; also sheet 8
SOL3_OUT: D3.A JS3.2 SOL3.5(OUT)
SOL4_EN: SOL4.8(IN) ; also sheet 8
SOL4_OUT: D4.A JS4.2 SOL4.5(OUT)
SOL5_EN: SOL5.8(IN) ; also sheet 8
SOL5_OUT: D5.A JS5.2 SOL5.5(OUT)
SOL6_EN: SOL6.8(IN) ; also sheet 8
SOL6_OUT: D6.A JS6.2 SOL6.5(OUT)

### Notes on the sheet
- 6 x Solenoid drivers
- 1 CTRL + 2xVP + 2xGND | Supplied from +VP4 (12V, 6A)
- 2xOUT+ 2xOUT-
- "Fault" | "Fault"
- Flyback 3A, 40V | Flyback 3A, 40V
- "Fault" | "Fault"
- Flyback 3A, 40V | Flyback 3A, 40V
- "Fault" | "Fault"
- Flyback 3A, 40V | Flyback 3A, 40V
- Initial 100% duty drive duration: | PWM Frequency: | PWM Duty-cycle:
- Delay ~= CD * 10^6 | Rfreq (MOhm) ~= 6808 / freq | Rpwm (kOhm) ~= 15 + 36 x DC[%] (for Rfreq = 100k)
- Delay ~= 10 ms => CD = 10 nF | freq ~= 50kHz => Rfreq = 100k | DC =  5% => Rpwm = 16.9k
- DC = 95% => Rpwm = 49.9k

## Sheet 6 of 8: Servos
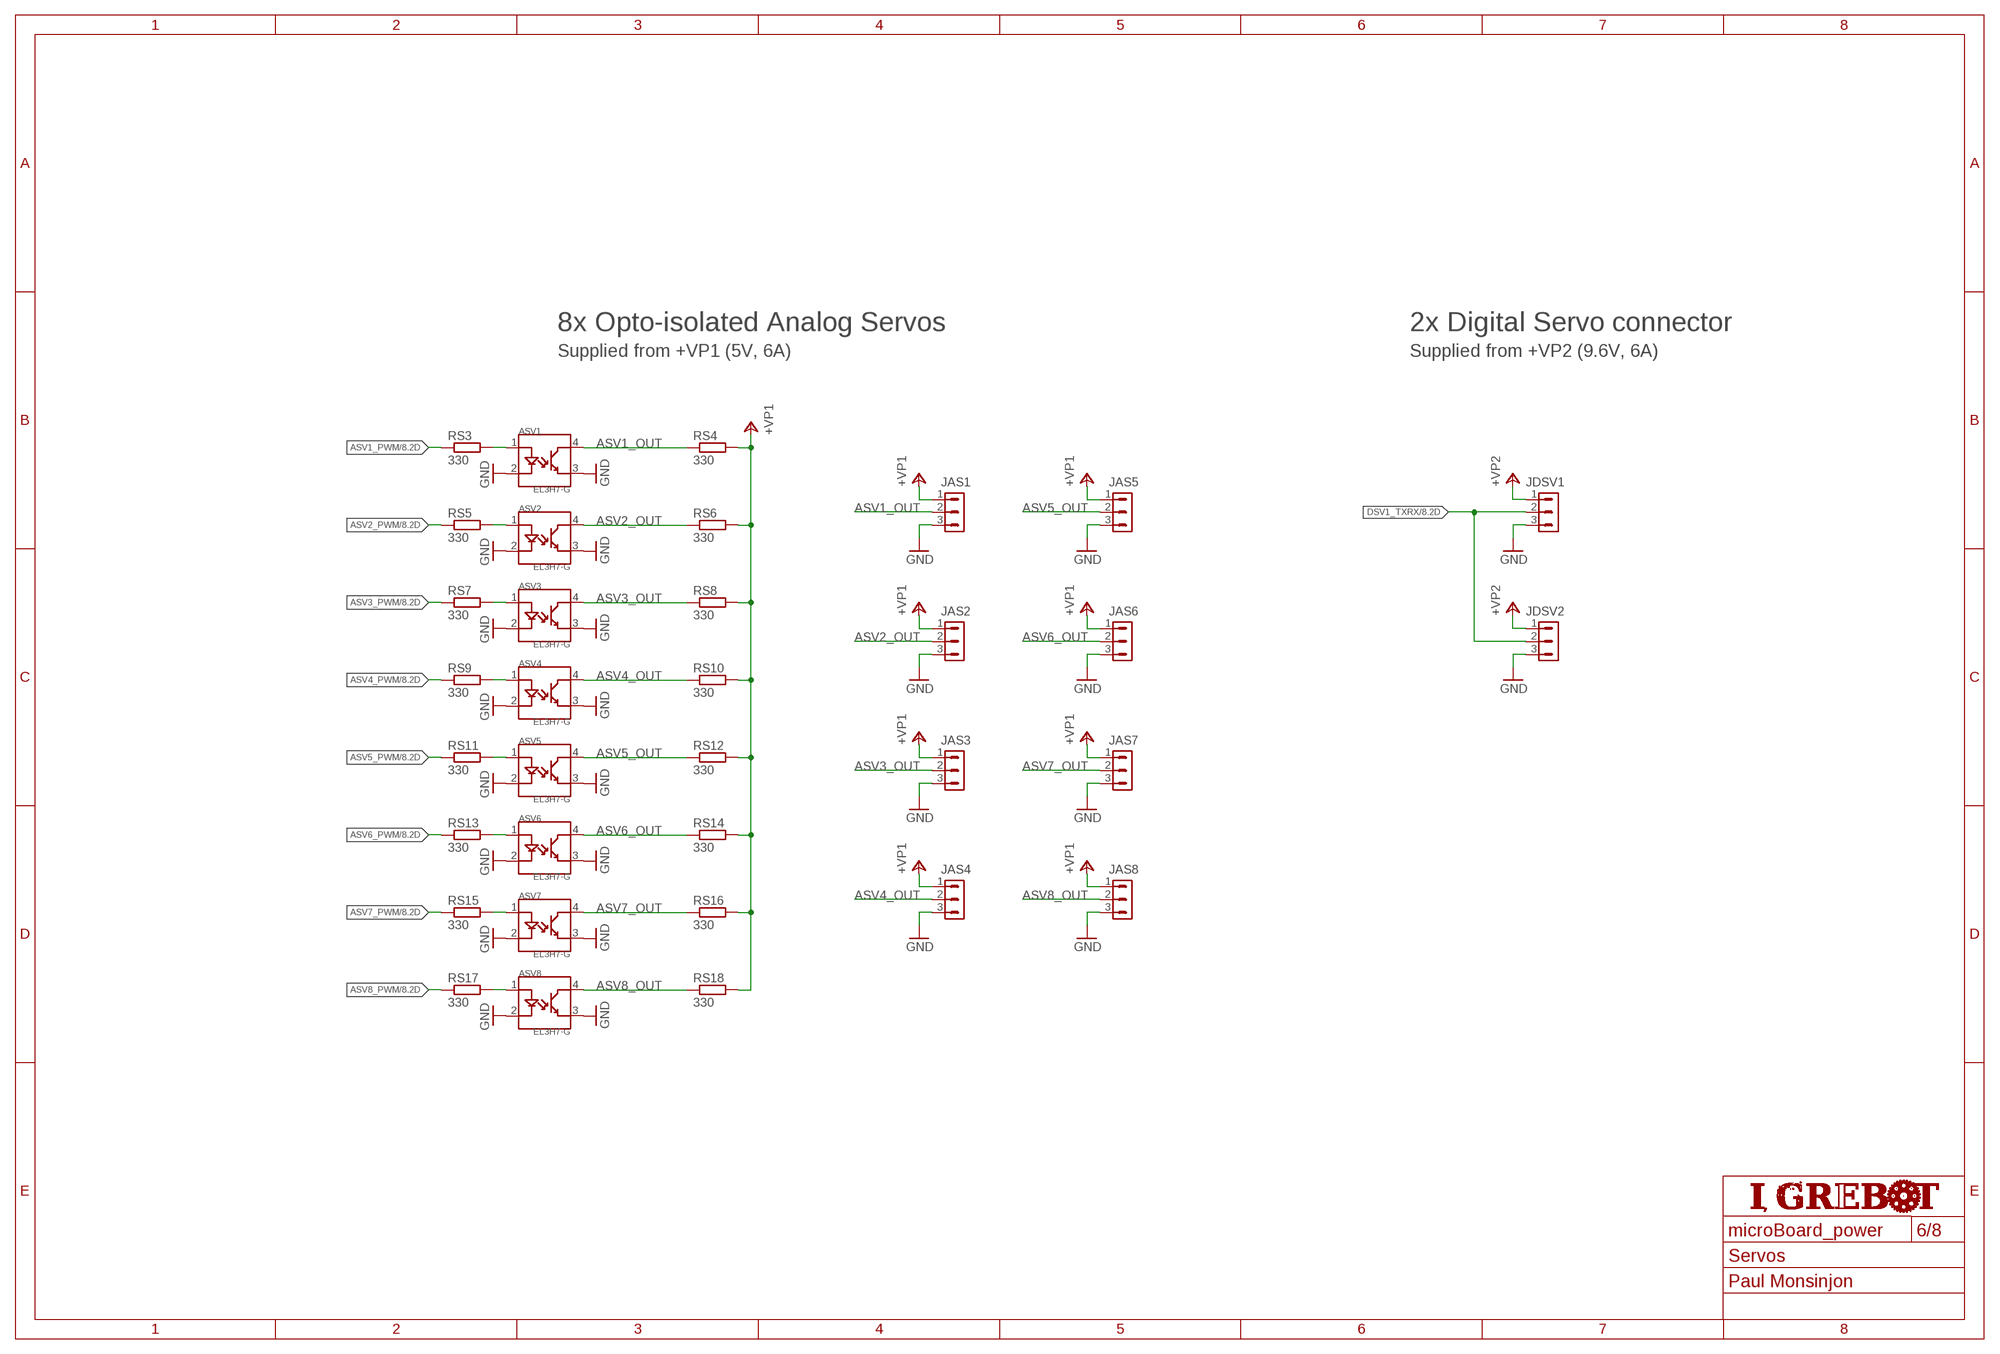
[diagram p5: schematic, sheet 6]
POWER-SUPPLIES4 (FRAME_A3): AUTHOR: Paul Monsinjon; SHEET_NAME: Servos

### Parts
ASV1  EL3H7-G  [SSOP_4]
ASV2  EL3H7-G  [SSOP_4]
ASV3  EL3H7-G  [SSOP_4]
ASV4  EL3H7-G  [SSOP_4]
ASV5  EL3H7-G  [SSOP_4]
ASV6  EL3H7-G  [SSOP_4]
ASV7  EL3H7-G  [SSOP_4]
ASV8  EL3H7-G  [SSOP_4]
JAS1  HE14_H_3  [HE14_H_3]
JAS2  HE14_H_3  [HE14_H_3]
JAS3  HE14_H_3  [HE14_H_3]
JAS4  HE14_H_3  [HE14_H_3]
JAS5  HE14_H_3  [HE14_H_3]
JAS6  HE14_H_3  [HE14_H_3]
JAS7  HE14_H_3  [HE14_H_3]
JAS8  HE14_H_3  [HE14_H_3]
JDSV1  HE14_H_3  [HE14_H_3]
JDSV2  HE14_H_3  [HE14_H_3]
RS3  330  R-EU_R0603  [R0603]
RS4  330  R-EU_R0603  [R0603]
RS5  330  R-EU_R0603  [R0603]
RS6  330  R-EU_R0603  [R0603]
RS7  330  R-EU_R0603  [R0603]
RS8  330  R-EU_R0603  [R0603]
RS9  330  R-EU_R0603  [R0603]
RS10  330  R-EU_R0603  [R0603]
RS11  330  R-EU_R0603  [R0603]
RS12  330  R-EU_R0603  [R0603]
RS13  330  R-EU_R0603  [R0603]
RS14  330  R-EU_R0603  [R0603]
RS15  330  R-EU_R0603  [R0603]
RS16  330  R-EU_R0603  [R0603]
RS17  330  R-EU_R0603  [R0603]
RS18  330  R-EU_R0603  [R0603]

### Nets
+VP1: JAS1.1 JAS2.1 JAS3.1 JAS4.1 JAS5.1 JAS6.1 JAS7.1 JAS8.1 RS4.2 RS6.2 RS8.2 RS10.2 RS12.2 RS14.2 RS16.2 RS18.2 ; also sheet 1
+VP2: JDSV1.1 JDSV2.1 ; also sheet 1
ASV1_OUT: ASV1.4 JAS1.2 RS4.1
ASV1_PWM: RS3.1 ; also sheet 8
ASV2_OUT: ASV2.4 JAS2.2 RS6.1
ASV2_PWM: RS5.1 ; also sheet 8
ASV3_OUT: ASV3.4 JAS3.2 RS8.1
ASV3_PWM: RS7.1 ; also sheet 8
ASV4_OUT: ASV4.4 JAS4.2 RS10.1
ASV4_PWM: RS9.1 ; also sheet 8
ASV5_OUT: ASV5.4 JAS5.2 RS12.1
ASV5_PWM: RS11.1 ; also sheet 8
ASV6_OUT: ASV6.4 JAS6.2 RS14.1
ASV6_PWM: RS13.1 ; also sheet 8
ASV7_OUT: ASV7.4 JAS7.2 RS16.1
ASV7_PWM: RS15.1 ; also sheet 8
ASV8_OUT: ASV8.4 JAS8.2 RS18.1
ASV8_PWM: RS17.1 ; also sheet 8
DSV1_TXRX: JDSV1.2 JDSV2.2 ; also sheet 8
GND: ASV1.2 ASV1.3 ASV2.2 ASV2.3 ASV3.2 ASV3.3 ASV4.2 ASV4.3 ASV5.2 ASV5.3 ASV6.2 ASV6.3 ASV7.2 ASV7.3 ASV8.2 ASV8.3 JAS1.3 JAS2.3 JAS3.3 JAS4.3 JAS5.3 JAS6.3 JAS7.3 JAS8.3 JDSV1.3 JDSV2.3 ; also sheet 1,2,3,4,5,7,8
N$50: ASV1.1 RS3.2
N$53: ASV2.1 RS5.2
N$54: ASV3.1 RS7.2
N$55: ASV4.1 RS9.2
N$56: ASV5.1 RS11.2
N$57: ASV6.1 RS13.2
N$58: ASV7.1 RS15.2
N$59: ASV8.1 RS17.2

### Notes on the sheet
- 8x Opto-isolated Analog Servos | 2x Digital Servo connector
- Supplied from +VP1 (5V, 6A) | Supplied from +VP2 (9.6V, 6A)

## Sheet 7 of 8: ADC
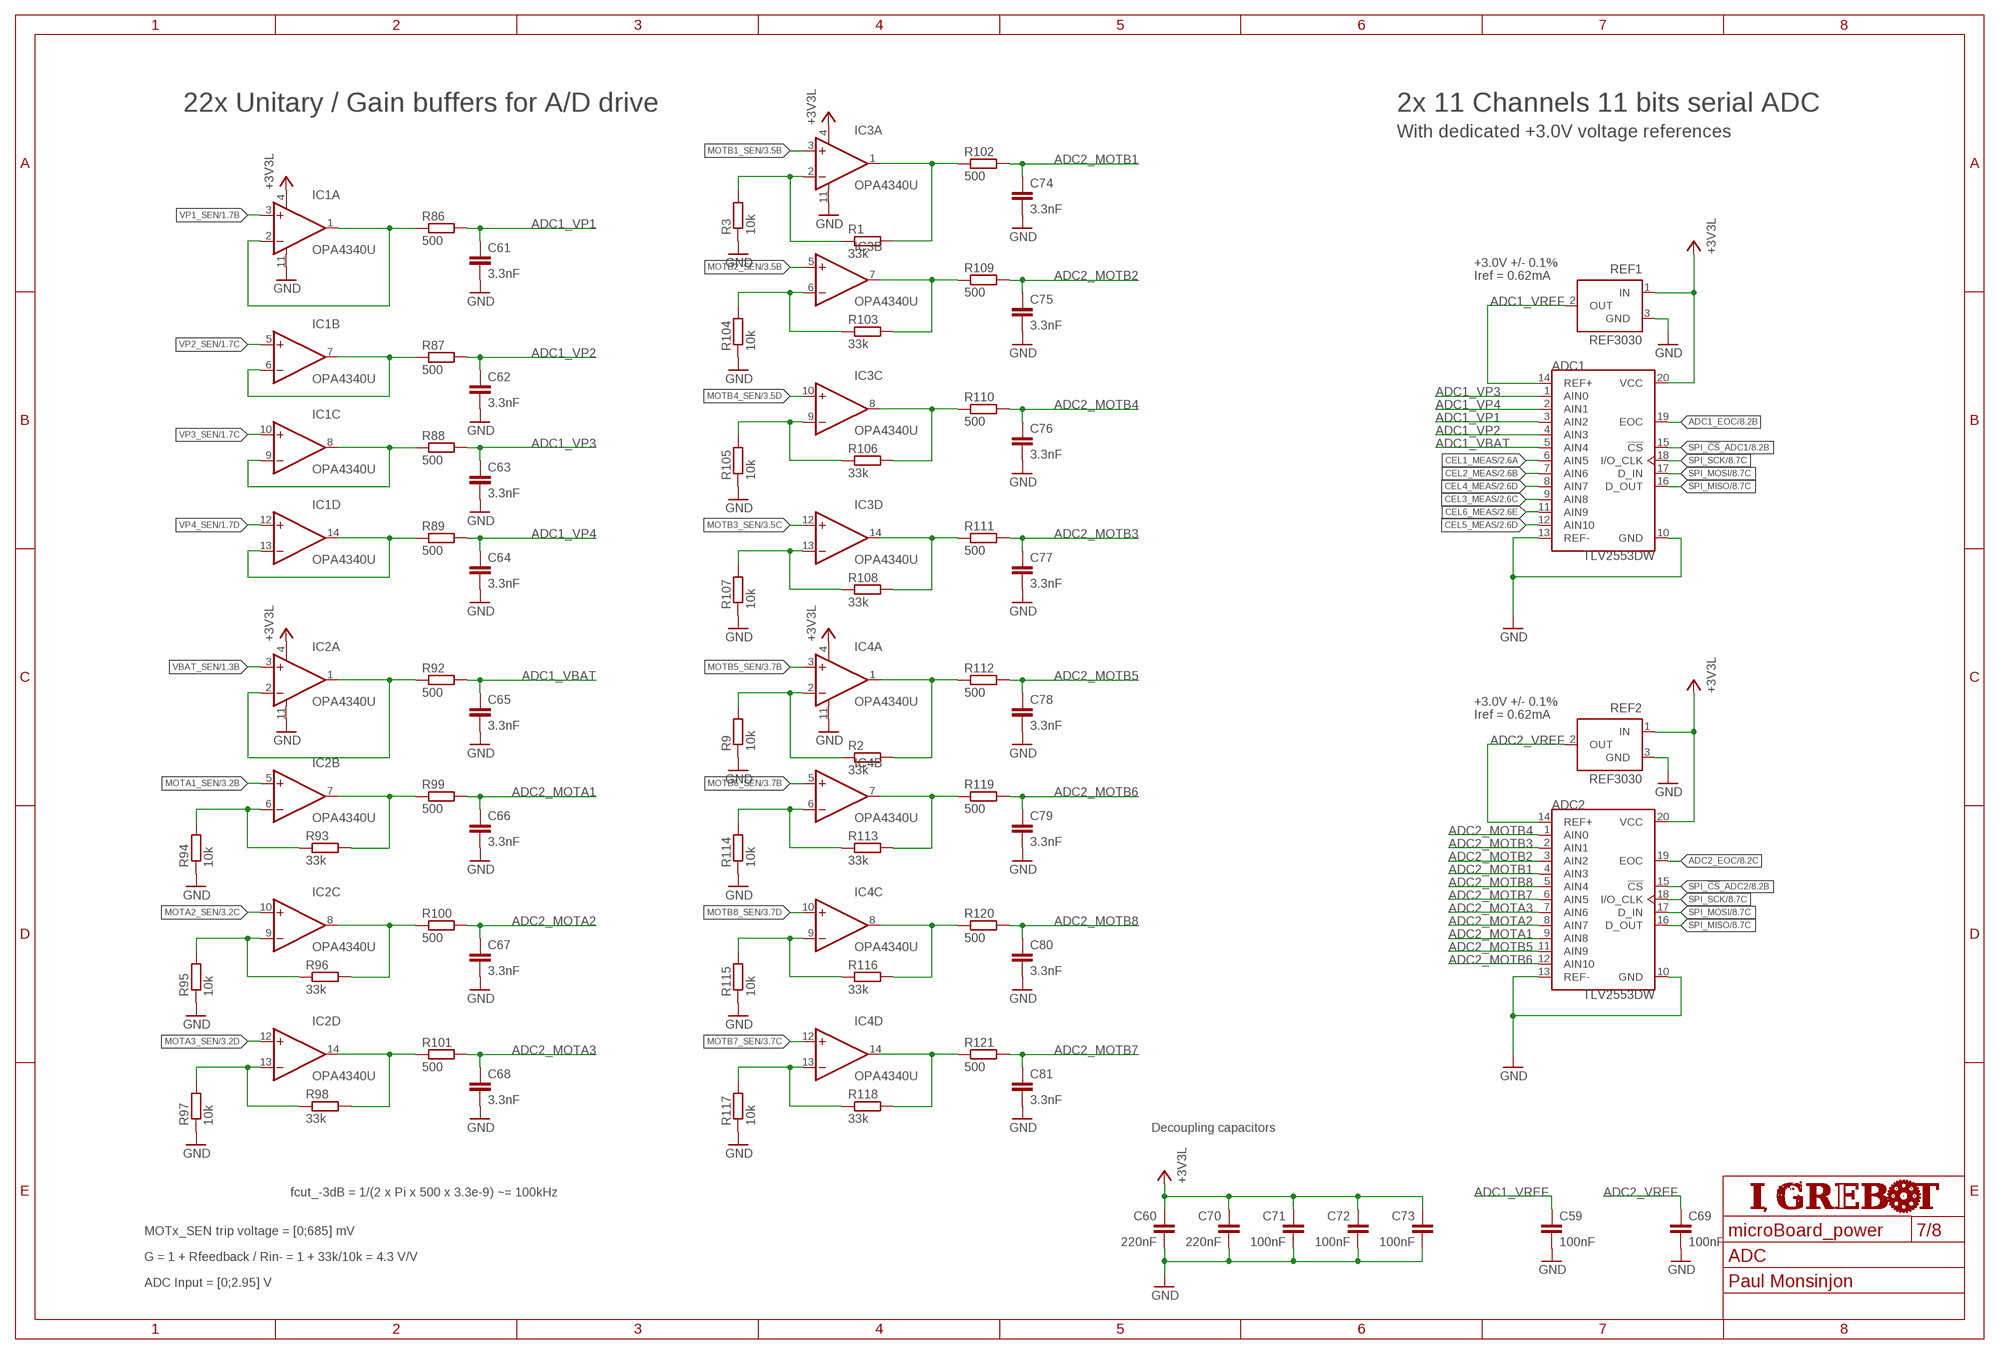
[diagram p6: schematic, sheet 7]
POWER-SUPPLIES6 (FRAME_A3): AUTHOR: Paul Monsinjon; SHEET_NAME: ADC

### Parts
ADC1  TLV2553DW  [SSOP_20]
ADC2  TLV2553DW  [SSOP_20]
C59  100nF  C-EUC0603  [C0603]
C60  220nF  C-EUC0603  [C0603]
C61  3.3nF  C-EUC0603  [C0603]
C62  3.3nF  C-EUC0603  [C0603]
C63  3.3nF  C-EUC0603  [C0603]
C64  3.3nF  C-EUC0603  [C0603]
C65  3.3nF  C-EUC0603  [C0603]
C66  3.3nF  C-EUC0603  [C0603]
C67  3.3nF  C-EUC0603  [C0603]
C68  3.3nF  C-EUC0603  [C0603]
C69  100nF  C-EUC0603  [C0603]
C70  220nF  C-EUC0603  [C0603]
C71  100nF  C-EUC0603  [C0603]
C72  100nF  C-EUC0603  [C0603]
C73  100nF  C-EUC0603  [C0603]
C74  3.3nF  C-EUC0603  [C0603]
C75  3.3nF  C-EUC0603  [C0603]
C76  3.3nF  C-EUC0603  [C0603]
C77  3.3nF  C-EUC0603  [C0603]
C78  3.3nF  C-EUC0603  [C0603]
C79  3.3nF  C-EUC0603  [C0603]
C80  3.3nF  C-EUC0603  [C0603]
C81  3.3nF  C-EUC0603  [C0603]
IC1  OPA4340U  [SO14]
IC2  OPA4340U  [SO14]
IC3  OPA4340U  [SO14]
IC4  OPA4340U  [SO14]
R1  33k  R-EU_R0603  [R0603]
R2  33k  R-EU_R0603  [R0603]
R3  10k  R-EU_R0603  [R0603]
R9  10k  R-EU_R0603  [R0603]
R86  500  R-EU_R0603  [R0603]
R87  500  R-EU_R0603  [R0603]
R88  500  R-EU_R0603  [R0603]
R89  500  R-EU_R0603  [R0603]
R92  500  R-EU_R0603  [R0603]
R93  33k  R-EU_R0603  [R0603]
R94  10k  R-EU_R0603  [R0603]
R95  10k  R-EU_R0603  [R0603]
R96  33k  R-EU_R0603  [R0603]
R97  10k  R-EU_R0603  [R0603]
R98  33k  R-EU_R0603  [R0603]
R99  500  R-EU_R0603  [R0603]
R100  500  R-EU_R0603  [R0603]
R101  500  R-EU_R0603  [R0603]
R102  500  R-EU_R0603  [R0603]
R103  33k  R-EU_R0603  [R0603]
R104  10k  R-EU_R0603  [R0603]
R105  10k  R-EU_R0603  [R0603]
R106  33k  R-EU_R0603  [R0603]
R107  10k  R-EU_R0603  [R0603]
R108  33k  R-EU_R0603  [R0603]
R109  500  R-EU_R0603  [R0603]
R110  500  R-EU_R0603  [R0603]
R111  500  R-EU_R0603  [R0603]
R112  500  R-EU_R0603  [R0603]
R113  33k  R-EU_R0603  [R0603]
R114  10k  R-EU_R0603  [R0603]
R115  10k  R-EU_R0603  [R0603]
R116  33k  R-EU_R0603  [R0603]
R117  10k  R-EU_R0603  [R0603]
R118  33k  R-EU_R0603  [R0603]
R119  500  R-EU_R0603  [R0603]
R120  500  R-EU_R0603  [R0603]
R121  500  R-EU_R0603  [R0603]
REF1  REF3030  MAX6520  [SOT23]
REF2  REF3030  MAX6520  [SOT23]

### Nets
+3V3L: ADC1.20(VCC) ADC2.20(VCC) C60.1 C70.1 C71.1 C72.1 C73.1 IC1.4(A:V+) IC2.4(A:V+) IC3.4(A:V+) IC4.4(A:V+) REF1.1(IN) REF2.1(IN) ; also sheet 1,3,8
ADC1_EOC: ADC1.19(EOC) ; also sheet 8
ADC1_VBAT: ADC1.5(AIN4) C65.1 R92.2
ADC1_VP1: ADC1.3(AIN2) C61.1 R86.2
ADC1_VP2: ADC1.4(AIN3) C62.1 R87.2
ADC1_VP3: ADC1.1(AIN0) C63.1 R88.2
ADC1_VP4: ADC1.2(AIN1) C64.1 R89.2
ADC1_VREF: ADC1.14(REF+) C59.1 REF1.2(OUT)
ADC2_EOC: ADC2.19(EOC) ; also sheet 8
ADC2_MOTA1: ADC2.9(AIN8) C66.1 R99.2
ADC2_MOTA2: ADC2.8(AIN7) C67.1 R100.2
ADC2_MOTA3: ADC2.7(AIN6) C68.1 R101.2
ADC2_MOTB1: ADC2.4(AIN3) C74.1 R102.2
ADC2_MOTB2: ADC2.3(AIN2) C75.1 R109.2
ADC2_MOTB3: ADC2.2(AIN1) C77.1 R111.2
ADC2_MOTB4: ADC2.1(AIN0) C76.1 R110.2
ADC2_MOTB5: ADC2.11(AIN9) C78.1 R112.2
ADC2_MOTB6: ADC2.12(AIN10) C79.1 R119.2
ADC2_MOTB7: ADC2.6(AIN5) C81.1 R121.2
ADC2_MOTB8: ADC2.5(AIN4) C80.1 R120.2
ADC2_VREF: ADC2.14(REF+) C69.1 REF2.2(OUT)
CEL1_MEAS: ADC1.6(AIN5) ; also sheet 2
CEL2_MEAS: ADC1.7(AIN6) ; also sheet 2
CEL3_MEAS: ADC1.9(AIN8) ; also sheet 2
CEL4_MEAS: ADC1.8(AIN7) ; also sheet 2
CEL5_MEAS: ADC1.12(AIN10) ; also sheet 2
CEL6_MEAS: ADC1.11(AIN9) ; also sheet 2
GND: ADC1.10(GND) ADC1.13(REF-) ADC2.10(GND) ADC2.13(REF-) C59.2 C60.2 C61.2 C62.2 C63.2 C64.2 C65.2 C66.2 C67.2 C68.2 C69.2 C70.2 C71.2 C72.2 C73.2 C74.2 C75.2 C76.2 C77.2 C78.2 C79.2 C80.2 C81.2 IC1.11(A:V-) IC2.11(A:V-) IC3.11(A:V-) IC4.11(A:V-) R3.1 R9.1 R94.1 R95.1 R97.1 R104.1 R105.1 R107.1 R114.1 R115.1 R117.1 REF1.3(GND) REF2.3(GND) ; also sheet 1,2,3,4,5,6,8
MOTA1_SEN: IC2.5(B:+IN) ; also sheet 3
MOTA2_SEN: IC2.10(C:+IN) ; also sheet 3
MOTA3_SEN: IC2.12(D:+IN) ; also sheet 3
MOTB1_SEN: IC3.3(A:+IN) ; also sheet 3
MOTB2_SEN: IC3.5(B:+IN) ; also sheet 3
MOTB3_SEN: IC3.12(D:+IN) ; also sheet 3
MOTB4_SEN: IC3.10(C:+IN) ; also sheet 3
MOTB5_SEN: IC4.3(A:+IN) ; also sheet 3
MOTB6_SEN: IC4.5(B:+IN) ; also sheet 3
MOTB7_SEN: IC4.12(D:+IN) ; also sheet 3
MOTB8_SEN: IC4.10(C:+IN) ; also sheet 3
N$35: IC3.2(A:-IN) R1.1 R3.2
N$36: IC4.2(A:-IN) R2.1 R9.2
N$107: IC1.6(B:-IN) IC1.7(B:OUT) R87.1
N$110: IC1.8(C:OUT) IC1.9(C:-IN) R88.1
N$113: IC1.13(D:-IN) IC1.14(D:OUT) R89.1
N$117: IC1.1(A:OUT) IC1.2(A:-IN) R86.1
N$135: IC2.1(A:OUT) IC2.2(A:-IN) R92.1
N$136: IC2.7(B:OUT) R93.2 R99.1
N$137: IC2.8(C:OUT) R96.2 R100.1
N$138: IC2.14(D:OUT) R98.2 R101.1
N$140: IC2.6(B:-IN) R93.1 R94.2
N$141: IC2.9(C:-IN) R95.2 R96.1
N$142: IC2.13(D:-IN) R97.2 R98.1
N$150: IC3.1(A:OUT) R1.2 R102.1
N$151: IC3.7(B:OUT) R103.2 R109.1
N$152: IC3.8(C:OUT) R106.2 R110.1
N$153: IC3.14(D:OUT) R108.2 R111.1
N$154: IC3.6(B:-IN) R103.1 R104.2
N$155: IC3.9(C:-IN) R105.2 R106.1
N$156: IC3.13(D:-IN) R107.2 R108.1
N$157: IC4.1(A:OUT) R2.2 R112.1
N$158: IC4.7(B:OUT) R113.2 R119.1
N$159: IC4.8(C:OUT) R116.2 R120.1
N$160: IC4.14(D:OUT) R118.2 R121.1
N$161: IC4.6(B:-IN) R113.1 R114.2
N$162: IC4.9(C:-IN) R115.2 R116.1
N$163: IC4.13(D:-IN) R117.2 R118.1
SPI_!CS!_ADC1: ADC1.15(!CS!) ; also sheet 8
SPI_!CS!_ADC2: ADC2.15(!CS!) ; also sheet 8
SPI_MISO: ADC1.16(D_OUT) ADC2.16(D_OUT) ; also sheet 8
SPI_MOSI: ADC1.17(D_IN) ADC2.17(D_IN) ; also sheet 8
SPI_SCK: ADC1.18(I/O_CLK) ADC2.18(I/O_CLK) ; also sheet 8
VBAT_SEN: IC2.3(A:+IN) ; also sheet 1
VP1_SEN: IC1.3(A:+IN) ; also sheet 1
VP2_SEN: IC1.5(B:+IN) ; also sheet 1
VP3_SEN: IC1.10(C:+IN) ; also sheet 1
VP4_SEN: IC1.12(D:+IN) ; also sheet 1

### Notes on the sheet
- 22x Unitary / Gain buffers for A/D drive | 2x 11 Channels 11 bits serial ADC
- With dedicated +3.0V voltage references
- +3.0V +/- 0.1%
- Iref = 0.62mA
- +3.0V +/- 0.1%
- Iref = 0.62mA
- Decoupling capacitors
- fcut_-3dB = 1/(2 x Pi x 500 x 3.3e-9) ~= 100kHz
- MOTx_SEN trip voltage = [0;685] mV
- G = 1 + Rfeedback / Rin- = 1 + 33k/10k = 4.3 V/V
- ADC Input = [0;2.95] V

## Sheet 8 of 8: Main board interface
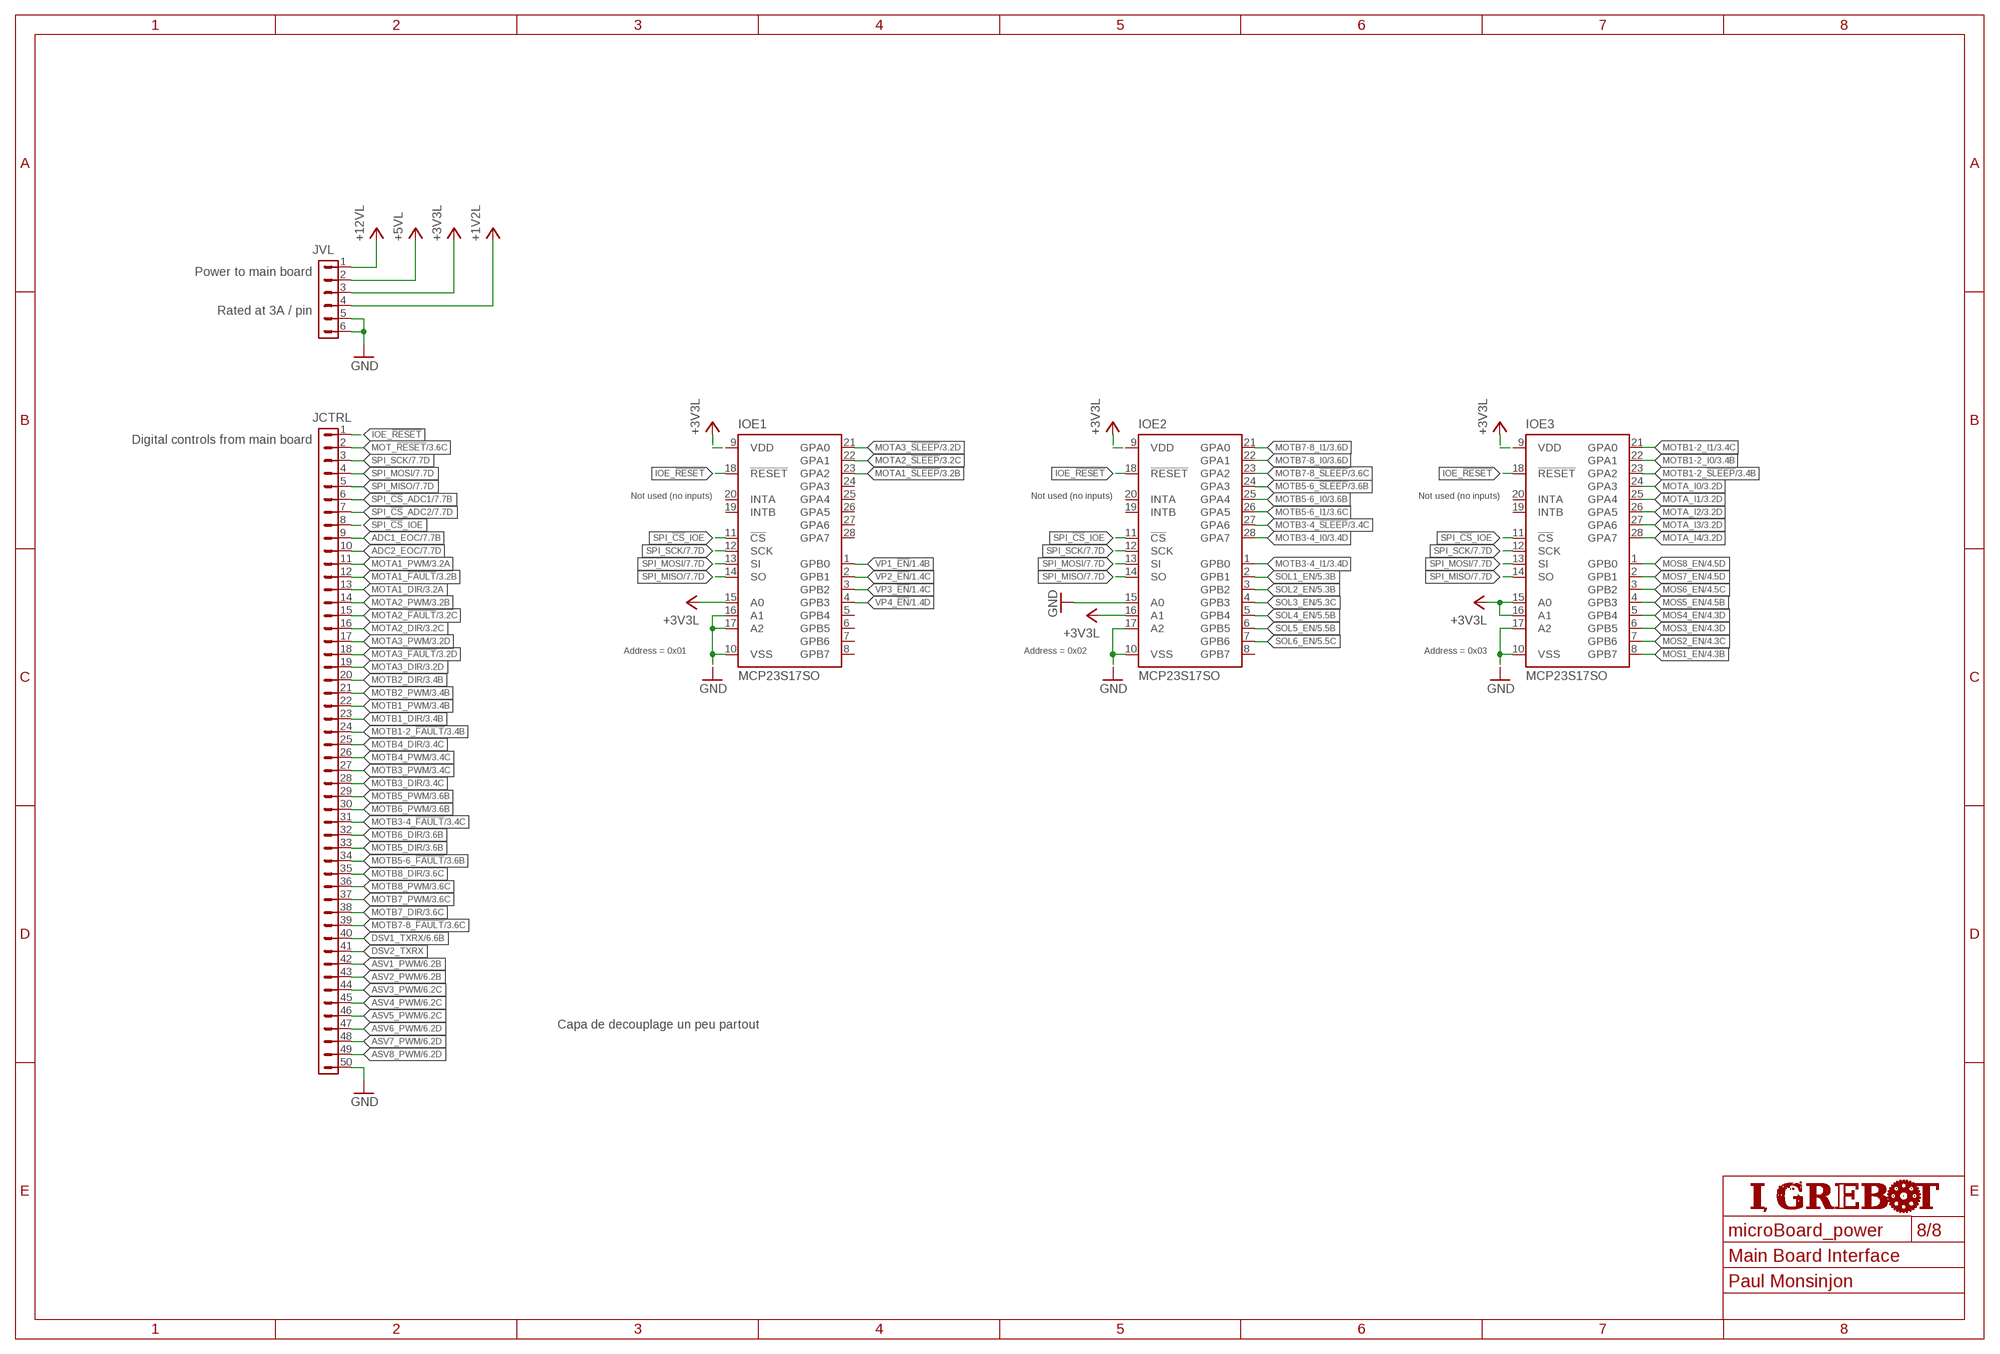
[diagram p7: schematic, sheet 8]
POWER-SUPPLIES1 (FRAME_A3): AUTHOR: Paul Monsinjon; SHEET_NAME: Main Board Interface

### Parts
IOE1  MCP23S17SO  [SO28W]
IOE2  MCP23S17SO  [SO28W]
IOE3  MCP23S17SO  [SO28W]
JCTRL  FFC-0.5_50  [FFC-SMD-0.5_50]
JVL  HE14_H_6  [HE14_H_6]

### Nets
+1V2L: JVL.4 ; also sheet 1
+3V3L: IOE1.9(VDD) IOE1.15(A0) IOE2.9(VDD) IOE2.16(A1) IOE3.9(VDD) IOE3.15(A0) IOE3.16(A1) JVL.3 ; also sheet 1,3,7
+5VL: JVL.2 ; also sheet 1,2
+12VL: JVL.1 ; also sheet 1
ADC1_EOC: JCTRL.9 ; also sheet 7
ADC2_EOC: JCTRL.10 ; also sheet 7
ASV1_PWM: JCTRL.42 ; also sheet 6
ASV2_PWM: JCTRL.43 ; also sheet 6
ASV3_PWM: JCTRL.44 ; also sheet 6
ASV4_PWM: JCTRL.45 ; also sheet 6
ASV5_PWM: JCTRL.46 ; also sheet 6
ASV6_PWM: JCTRL.47 ; also sheet 6
ASV7_PWM: JCTRL.48 ; also sheet 6
ASV8_PWM: JCTRL.49 ; also sheet 6
DSV1_TXRX: JCTRL.40 ; also sheet 6
DSV2_TXRX: JCTRL.41
GND: IOE1.10(VSS) IOE1.16(A1) IOE1.17(A2) IOE2.10(VSS) IOE2.15(A0) IOE2.17(A2) IOE3.10(VSS) IOE3.17(A2) JCTRL.50 JVL.5 JVL.6 ; also sheet 1,2,3,4,5,6,7
IOE_!RESET!: IOE1.18(!RESET) IOE2.18(!RESET) IOE3.18(!RESET) JCTRL.1
MOS1_EN: IOE3.8(GPB7) ; also sheet 4
MOS2_EN: IOE3.7(GPB6) ; also sheet 4
MOS3_EN: IOE3.6(GPB5) ; also sheet 4
MOS4_EN: IOE3.5(GPB4) ; also sheet 4
MOS5_EN: IOE3.4(GPB3) ; also sheet 4
MOS6_EN: IOE3.3(GPB2) ; also sheet 4
MOS7_EN: IOE3.2(GPB1) ; also sheet 4
MOS8_EN: IOE3.1(GPB0) ; also sheet 4
MOT_!RESET!: JCTRL.2 ; also sheet 3
MOTA1_!FAULT!: JCTRL.12 ; also sheet 3
MOTA1_!SLEEP!: IOE1.23(GPA2) ; also sheet 3
MOTA1_DIR: JCTRL.13 ; also sheet 3
MOTA1_PWM: JCTRL.11 ; also sheet 3
MOTA2_!FAULT!: JCTRL.15 ; also sheet 3
MOTA2_!SLEEP!: IOE1.22(GPA1) ; also sheet 3
MOTA2_DIR: JCTRL.16 ; also sheet 3
MOTA2_PWM: JCTRL.14 ; also sheet 3
MOTA3_!FAULT!: JCTRL.18 ; also sheet 3
MOTA3_!SLEEP!: IOE1.21(GPA0) ; also sheet 3
MOTA3_DIR: JCTRL.19 ; also sheet 3
MOTA3_PWM: JCTRL.17 ; also sheet 3
MOTA_I0: IOE3.24(GPA3) ; also sheet 3
MOTA_I1: IOE3.25(GPA4) ; also sheet 3
MOTA_I2: IOE3.26(GPA5) ; also sheet 3
MOTA_I3: IOE3.27(GPA6) ; also sheet 3
MOTA_I4: IOE3.28(GPA7) ; also sheet 3
MOTB1-2_!FAULT!: JCTRL.24 ; also sheet 3
MOTB1-2_!SLEEP!: IOE3.23(GPA2) ; also sheet 3
MOTB1-2_I0: IOE3.22(GPA1) ; also sheet 3
MOTB1-2_I1: IOE3.21(GPA0) ; also sheet 3
MOTB1_DIR: JCTRL.23 ; also sheet 3
MOTB1_PWM: JCTRL.22 ; also sheet 3
MOTB2_DIR: JCTRL.20 ; also sheet 3
MOTB2_PWM: JCTRL.21 ; also sheet 3
MOTB3-4_!FAULT!: JCTRL.31 ; also sheet 3
MOTB3-4_!SLEEP!: IOE2.27(GPA6) ; also sheet 3
MOTB3-4_I0: IOE2.28(GPA7) ; also sheet 3
MOTB3-4_I1: IOE2.1(GPB0) ; also sheet 3
MOTB3_DIR: JCTRL.28 ; also sheet 3
MOTB3_PWM: JCTRL.27 ; also sheet 3
MOTB4_DIR: JCTRL.25 ; also sheet 3
MOTB4_PWM: JCTRL.26 ; also sheet 3
MOTB5-6_!FAULT!: JCTRL.34 ; also sheet 3
MOTB5-6_!SLEEP!: IOE2.24(GPA3) ; also sheet 3
MOTB5-6_I0: IOE2.25(GPA4) ; also sheet 3
MOTB5-6_I1: IOE2.26(GPA5) ; also sheet 3
MOTB5_DIR: JCTRL.33 ; also sheet 3
MOTB5_PWM: JCTRL.29 ; also sheet 3
MOTB6_DIR: JCTRL.32 ; also sheet 3
MOTB6_PWM: JCTRL.30 ; also sheet 3
MOTB7-8_!FAULT!: JCTRL.39 ; also sheet 3
MOTB7-8_!SLEEP!: IOE2.23(GPA2) ; also sheet 3
MOTB7-8_I0: IOE2.22(GPA1) ; also sheet 3
MOTB7-8_I1: IOE2.21(GPA0) ; also sheet 3
MOTB7_DIR: JCTRL.38 ; also sheet 3
MOTB7_PWM: JCTRL.37 ; also sheet 3
MOTB8_DIR: JCTRL.35 ; also sheet 3
MOTB8_PWM: JCTRL.36 ; also sheet 3
SOL1_EN: IOE2.2(GPB1) ; also sheet 5
SOL2_EN: IOE2.3(GPB2) ; also sheet 5
SOL3_EN: IOE2.4(GPB3) ; also sheet 5
SOL4_EN: IOE2.5(GPB4) ; also sheet 5
SOL5_EN: IOE2.6(GPB5) ; also sheet 5
SOL6_EN: IOE2.7(GPB6) ; also sheet 5
SPI_!CS!_ADC1: JCTRL.6 ; also sheet 7
SPI_!CS!_ADC2: JCTRL.7 ; also sheet 7
SPI_!CS!_IOE: IOE1.11(!CS) IOE2.11(!CS) IOE3.11(!CS) JCTRL.8
SPI_MISO: IOE1.14(SO) IOE2.14(SO) IOE3.14(SO) JCTRL.5 ; also sheet 7
SPI_MOSI: IOE1.13(SI) IOE2.13(SI) IOE3.13(SI) JCTRL.4 ; also sheet 7
SPI_SCK: IOE1.12(SCK) IOE2.12(SCK) IOE3.12(SCK) JCTRL.3 ; also sheet 7
VP1_!EN!: IOE1.1(GPB0) ; also sheet 1
VP2_!EN!: IOE1.2(GPB1) ; also sheet 1
VP3_!EN!: IOE1.3(GPB2) ; also sheet 1
VP4_!EN!: IOE1.4(GPB3) ; also sheet 1
Unconnected: IOE1.5(GPB4) IOE1.6(GPB5) IOE1.7(GPB6) IOE1.8(GPB7) IOE1.19(INTB) IOE1.20(INTA) IOE1.24(GPA3) IOE1.25(GPA4) IOE1.26(GPA5) IOE1.27(GPA6) IOE1.28(GPA7) IOE2.8(GPB7) IOE2.19(INTB) IOE2.20(INTA) IOE3.19(INTB) IOE3.20(INTA)

### Notes on the sheet
- Power to main board
- Rated at 3A / pin
- Digital controls from main board
- Not used (no inputs) | Not used (no inputs) | Not used (no inputs)
- Address = 0x01 | Address = 0x02 | Address = 0x03
- Capa de decouplage un peu partout

## Library data of the parts
ADC1 ADC2 = microLib:TLV2553DW
ASV1-ASV8 = microLib:EL3H7-G
C1-C17 C20 C22 C24 C26-C81 = rcl:C-EU: CAPACITOR, European symbol
C18 C19 C21 C23 C25 = rcl:CPOL-EU: POLARIZED CAPACITOR, European symbol
CEL1-CEL6 = microLib:LT1990
D1-D6 = diode:MBRS3*0T3: SCHOTTKY BARRIER RECTIFIER 3.0 AMPERES 20, 30, 40 VOLT Source: MBRS340T3-D.pdf
IC1-IC4 = burr-brown:OPA4340: Operational Amplifiers Source: http://focus.ti.com/lit/ds/sbos073/sbos073.pdf; MF: TEXAS INSTRUMENTS; MPN: OPA4340UA; OC_FARNELL: 1212307; OC_NEWARK: 35C1907
IOE1-IOE3 = microchip:MCP23S17: http://ww1.microchip.com/downloads/en/DeviceDoc/21952a.pdf Source: http://ww1.microchip.com/downloads/en/DeviceDoc/21952a.pdf; MF: MICROCHIP; MPN: MCP23S17-E/SO; OC_FARNELL: unknown; OC_NEWARK: 31K2950
J1 = microLib:JST-XH-S_7
JA1-JA3 JB1-JB8 = microLib:MC15-G-3-3.81_2
JAS1-JAS8 JDSV1 JDSV2 = microLib:HE14_H_3
JBAT1 = microLib:MC15-GF-3.81-LR_2
JCTRL = microLib:FFC-0.5_50
JM1-JM8 JS1-JS6 = microLib:CON_2.54_H_2
JSW = microLib:MC15-GF-3.81-LR_4
JVL = microLib:HE14_H_6
L4-L7 = inductors:DR1030: DR1030 Series Low Profile Power Inductors Source: Data sheet <http://www.cooperbussmann.com/pdf/c73e479f-f867-4c64-ae26-9c1f23814163.pdf>
LED1-LED6 = led:LED: LED OSRAM: - CHIPLED LG R971, LG N971, LY N971, LG Q971, LY Q971, LO R971, LY R971 LH N974, LH R974 LS Q976, LO Q976, LY Q976 LO Q996 - Hyper CHIPLED LW Q18S LB Q993, LB Q99A, LB R99A - SideLED LS A670, LO A670, LY A670, LG A670, LP A670 LB A673, LV A673, LT A673, LW A673 LH A674 LY A675 LS A676, LA A676, LO A676, LY A676, LW A676 LS A679, LY A679, LG A679 - Hyper Micro SIDELED® LS Y876, LA Y876, LO Y876, LY Y876 LT Y87S - SmartLED LW L88C, LW L88S LB L89C, LB L89S, LG L890 LS L89K, LO L89K, LY L89K LS L896, LA L896, LO L896, LY L896 - TOPLED LS T670, LO T670, LY T670, LG T670, LP T670 LSG T670, LSP T670, LSY T670, LOP T670, LYG T670 LG T671, LOG T671, LSG T671 LB T673, LV T673, LT T673, LW T673 LH T674 LS T676, LA T676, LO T676, LY T676, LB T676, LH T676, LSB T676, LW T676 LB T67C, LV T67C, LT T67C, LS T67K, LO T67K, LY T67K, LW E67C LS E67B, LA E67B, LO E67B, LY E67B, LB E67C, LV E67C, LT E67C LW T67C LS T679, LY T679, LG T679 LS T770, LO T770, LY T770, LG T770, LP T770 LB T773, LV T773, LT T773, LW T773 LH T774 LS E675, LA E675, LY E675, LS T675 LS T776, LA T776, LO T776, LY T776, LB T776 LHGB T686 LT T68C, LB T68C - Hyper Mini TOPLED® LB M676 - Mini TOPLED Santana® LG M470 LS M47K, LO M47K, LY M47K Source: http://www.osram.convergy.de LUXEON: - LUMILED® LXK2-PW12-R00, LXK2-PW12-S00, LXK2-PW14-U00, LXK2-PW14-V00 LXK2-PM12-R00, LXK2-PM12-S00, LXK2-PM14-U00 LXK2-PE12-Q00, LXK2-PE12-R00, LXK2-PE12-S00, LXK2-PE14-T00, LXK2-PE14-U00 LXK2-PB12-K00, LXK2-PB12-L00, LXK2-PB12-M00, LXK2-PB14-N00, LXK2-PB14-P00, LXK2-PB14-Q00 LXK2-PR12-L00, LXK2-PR12-M00, LXK2-PR14-Q00, LXK2-PR14-R00 LXK2-PD12-Q00, LXK2-PD12-R00, LXK2-PD12-S00 LXK2-PH12-R00, LXK2-PH12-S00 LXK2-PL12-P00, LXK2-PL12-Q00, LXK2-PL12-R00 Source: www.luxeon.com KINGBRIGHT: KA-3528ASYC Source: www.kingbright.com
MOS1-MOS8 = microLib:FDC6330L
MOTA1-MOTA3 = microLib:MODULE_DRV8842
MOTB1-2 MOTB3-4 MOTB5-6 MOTB7-8 = microLib:MODULE_DRV8843
P1-P11 = resistor:R-TRIMM: Trimm resistor
Q1-Q4 = SparkFun-DiscreteSemi:MOSFET-NCHANNEL: Common NMOSFET Parts MFG P/N Store ID Prod ID FDD8780 TRANS-09984 SI7820DN TRANS-11055 FDS6630A IC-08089 2N7002PW TRANS-11151 FQP30N06L COM-10213 TRANS-10060 BSS123LT1G TRANS-08345 BSS138 TRANS-00830 BS170 2N7000; PROD_ID: TRANS-00830
R1-R9 R11-R17 R86-R121 = rcl:R-EU_: RESISTOR, European symbol
R10 R25-R85 RS3-RS18 = resistor:R-EU_: RESISTOR, European symbol
REF1 REF2 = maxim:MAX6520: 1.2V Voltage Reference 50ppm/°C, SOT23, 3-Terminal Source: Data sheet <http://datasheets.maxim-ic.com/en/ds/MAX6520.pdf>; MF: MAXIM; MPN: MAX6520EUR-T; OC_FARNELL: unknown; OC_NEWARK: 02J4586
SENSE_VBAT SENSE_VP1-SENSE_VP4 = microLib:INA138
SOL1-SOL6 = microLib:DRV103
VCC12 VCC33 VCC50 VCC120 = microLib:TSR_1-24XX
VP1-VP4 = microLib:PTN78020W